# EasyEDA Pro project Chronos-Pad-EasyEDApro-Save.epro

# Schematic Schematic1
Board Name: Board1; Create Date: 2025-09-28; Page Name: P1; Project Name: MacroPad; Schematic Name: Schematic1; Update Date: 2025-10-20; Company: EasyEDA.com; Page Size: A4; Version: V1.0
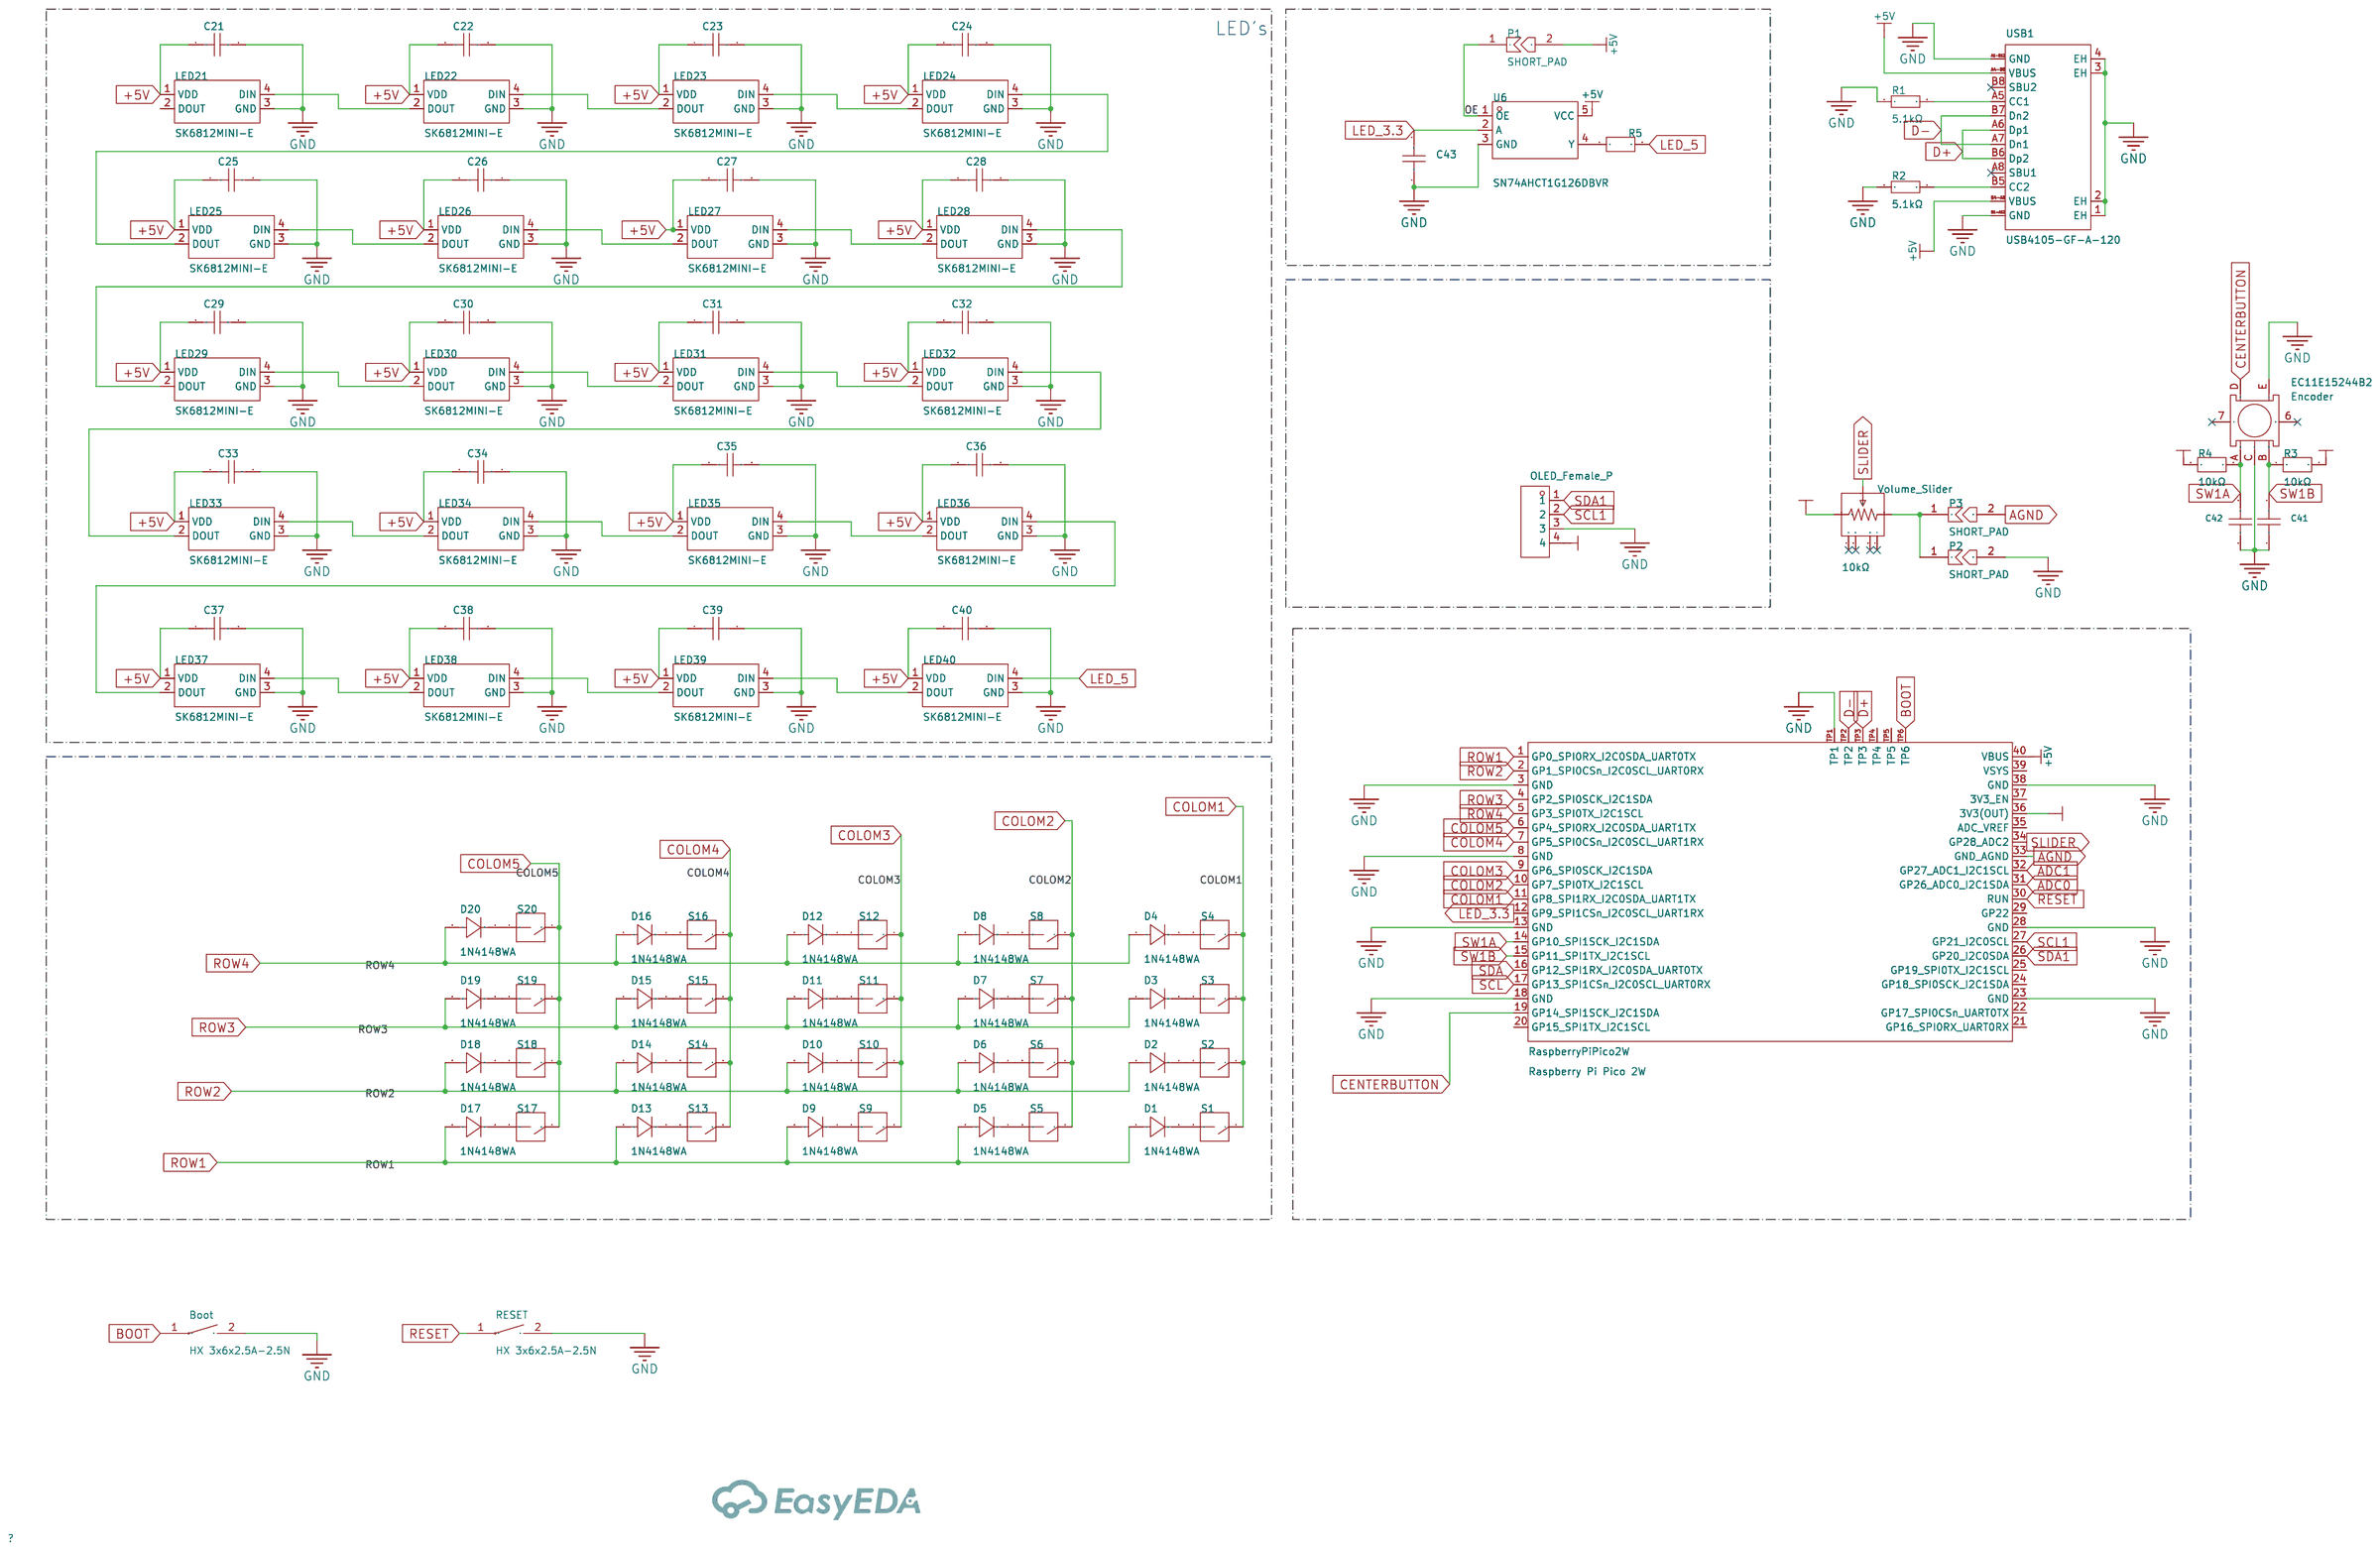
[diagram p0: schematic sheet]

## Parts
Boot  HX 3x6x2.5A-2.5N  [SW-SMD_HX-TS-1101-C-W]
C21  100nF  [C0805]
C22  100nF  [C0805]
C23  100nF  [C0805]
C24  100nF  [C0805]
C25  100nF  [C0805]
C26  100nF  [C0805]
C27  100nF  [C0805]
C28  100nF  [C0805]
C29  100nF  [C0805]
C30  100nF  [C0805]
C31  100nF  [C0805]
C32  100nF  [C0805]
C33  100nF  [C0805]
C34  100nF  [C0805]
C35  100nF  [C0805]
C36  100nF  [C0805]
C37  100nF  [C0805]
C38  100nF  [C0805]
C39  100nF  [C0805]
C40  100nF  [C0805]
C41  100nF  [C0805]
C42  100nF  [C0805]
C43  100nF  [C0805]
D1  1N4148WA  [SOD-123_L2.7-W1.7-LS3.8-RD]
D2  1N4148WA  [SOD-123_L2.7-W1.7-LS3.8-RD]
D3  1N4148WA  [SOD-123_L2.7-W1.7-LS3.8-RD]
D4  1N4148WA  [SOD-123_L2.7-W1.7-LS3.8-RD]
D5  1N4148WA  [SOD-123_L2.7-W1.7-LS3.8-RD]
D6  1N4148WA  [SOD-123_L2.7-W1.7-LS3.8-RD]
D7  1N4148WA  [SOD-123_L2.7-W1.7-LS3.8-RD]
D8  1N4148WA  [SOD-123_L2.7-W1.7-LS3.8-RD]
D9  1N4148WA  [SOD-123_L2.7-W1.7-LS3.8-RD]
D10  1N4148WA  [SOD-123_L2.7-W1.7-LS3.8-RD]
D11  1N4148WA  [SOD-123_L2.7-W1.7-LS3.8-RD]
D12  1N4148WA  [SOD-123_L2.7-W1.7-LS3.8-RD]
D13  1N4148WA  [SOD-123_L2.7-W1.7-LS3.8-RD]
D14  1N4148WA  [SOD-123_L2.7-W1.7-LS3.8-RD]
D15  1N4148WA  [SOD-123_L2.7-W1.7-LS3.8-RD]
D16  1N4148WA  [SOD-123_L2.7-W1.7-LS3.8-RD]
D17  1N4148WA  [SOD-123_L2.7-W1.7-LS3.8-RD]
D18  1N4148WA  [SOD-123_L2.7-W1.7-LS3.8-RD]
D19  1N4148WA  [SOD-123_L2.7-W1.7-LS3.8-RD]
D20  1N4148WA  [SOD-123_L2.7-W1.7-LS3.8-RD]
Encoder  EC11E15244B2  [SW-TH_EC11XXXXXXXX]
LED21  SK6812MINI-E  [LED-SMD_L3.2-W2.8-LS5.9_SK6812MINI-E]
LED22  SK6812MINI-E  [LED-SMD_L3.2-W2.8-LS5.9_SK6812MINI-E]
LED23  SK6812MINI-E  [LED-SMD_L3.2-W2.8-LS5.9_SK6812MINI-E]
LED24  SK6812MINI-E  [LED-SMD_L3.2-W2.8-LS5.9_SK6812MINI-E]
LED25  SK6812MINI-E  [LED-SMD_L3.2-W2.8-LS5.9_SK6812MINI-E]
LED26  SK6812MINI-E  [LED-SMD_L3.2-W2.8-LS5.9_SK6812MINI-E]
LED27  SK6812MINI-E  [LED-SMD_L3.2-W2.8-LS5.9_SK6812MINI-E]
LED28  SK6812MINI-E  [LED-SMD_L3.2-W2.8-LS5.9_SK6812MINI-E]
LED29  SK6812MINI-E  [LED-SMD_L3.2-W2.8-LS5.9_SK6812MINI-E]
LED30  SK6812MINI-E  [LED-SMD_L3.2-W2.8-LS5.9_SK6812MINI-E]
LED31  SK6812MINI-E  [LED-SMD_L3.2-W2.8-LS5.9_SK6812MINI-E]
LED32  SK6812MINI-E  [LED-SMD_L3.2-W2.8-LS5.9_SK6812MINI-E]
LED33  SK6812MINI-E  [LED-SMD_L3.2-W2.8-LS5.9_SK6812MINI-E]
LED34  SK6812MINI-E  [LED-SMD_L3.2-W2.8-LS5.9_SK6812MINI-E]
LED35  SK6812MINI-E  [LED-SMD_L3.2-W2.8-LS5.9_SK6812MINI-E]
LED36  SK6812MINI-E  [LED-SMD_L3.2-W2.8-LS5.9_SK6812MINI-E]
LED37  SK6812MINI-E  [LED-SMD_L3.2-W2.8-LS5.9_SK6812MINI-E]
LED38  SK6812MINI-E  [LED-SMD_L3.2-W2.8-LS5.9_SK6812MINI-E]
LED39  SK6812MINI-E  [LED-SMD_L3.2-W2.8-LS5.9_SK6812MINI-E]
LED40  SK6812MINI-E  [LED-SMD_L3.2-W2.8-LS5.9_SK6812MINI-E]
OLED_Female_P  -  [CONN-TH_4P-P2.50-XH2.54-4P]
P1  SHORT_PAD  [SHORT_PAD]
P2  SHORT_PAD  [SHORT_PAD]
P3  SHORT_PAD  [SHORT_PAD]
R1  5.1kΩ  [R0805]
R2  5.1kΩ  [R0805]
R3  10kΩ  [R0805]
R4  10kΩ  [R0805]
R5  300Ω  [R0805]
RaspberryPiPico2W  Raspberry Pi Pico 2W  [COMM-SMD_L51.0-W21.0-P2.54_PICOW]
RESET  HX 3x6x2.5A-2.5N  [SW-SMD_HX-TS-1101-C-W]
S1  adafruit_electromech_KBD_SWITCH_KAILH_SOCKET_BOX_JADE_KAILH_SOCKET  [KAILH_SOCKET]
S2  adafruit_electromech_KBD_SWITCH_KAILH_SOCKET_BOX_JADE_KAILH_SOCKET  [KAILH_SOCKET]
S3  adafruit_electromech_KBD_SWITCH_KAILH_SOCKET_BOX_JADE_KAILH_SOCKET  [KAILH_SOCKET]
S4  adafruit_electromech_KBD_SWITCH_KAILH_SOCKET_BOX_JADE_KAILH_SOCKET  [KAILH_SOCKET]
S5  adafruit_electromech_KBD_SWITCH_KAILH_SOCKET_BOX_JADE_KAILH_SOCKET  [KAILH_SOCKET]
S6  adafruit_electromech_KBD_SWITCH_KAILH_SOCKET_BOX_JADE_KAILH_SOCKET  [KAILH_SOCKET]
S7  adafruit_electromech_KBD_SWITCH_KAILH_SOCKET_BOX_JADE_KAILH_SOCKET  [KAILH_SOCKET]
S8  adafruit_electromech_KBD_SWITCH_KAILH_SOCKET_BOX_JADE_KAILH_SOCKET  [KAILH_SOCKET]
S9  adafruit_electromech_KBD_SWITCH_KAILH_SOCKET_BOX_JADE_KAILH_SOCKET  [KAILH_SOCKET]
S10  adafruit_electromech_KBD_SWITCH_KAILH_SOCKET_BOX_JADE_KAILH_SOCKET  [KAILH_SOCKET]
S11  adafruit_electromech_KBD_SWITCH_KAILH_SOCKET_BOX_JADE_KAILH_SOCKET  [KAILH_SOCKET]
S12  adafruit_electromech_KBD_SWITCH_KAILH_SOCKET_BOX_JADE_KAILH_SOCKET  [KAILH_SOCKET]
S13  adafruit_electromech_KBD_SWITCH_KAILH_SOCKET_BOX_JADE_KAILH_SOCKET  [KAILH_SOCKET]
S14  adafruit_electromech_KBD_SWITCH_KAILH_SOCKET_BOX_JADE_KAILH_SOCKET  [KAILH_SOCKET]
S15  adafruit_electromech_KBD_SWITCH_KAILH_SOCKET_BOX_JADE_KAILH_SOCKET  [KAILH_SOCKET]
S16  adafruit_electromech_KBD_SWITCH_KAILH_SOCKET_BOX_JADE_KAILH_SOCKET  [KAILH_SOCKET]
S17  adafruit_electromech_KBD_SWITCH_KAILH_SOCKET_BOX_JADE_KAILH_SOCKET  [KAILH_SOCKET]
S18  adafruit_electromech_KBD_SWITCH_KAILH_SOCKET_BOX_JADE_KAILH_SOCKET  [KAILH_SOCKET]
S19  adafruit_electromech_KBD_SWITCH_KAILH_SOCKET_BOX_JADE_KAILH_SOCKET  [KAILH_SOCKET]
S20  adafruit_electromech_KBD_SWITCH_KAILH_SOCKET_BOX_JADE_KAILH_SOCKET  [KAILH_SOCKET]
U6  SN74AHCT1G126DBVR  [SOT-23-5_L3.0-W1.7-P0.95-LS2.8-BR]
USB1  USB4105-GF-A-120  [USB-C-SMD_MC-311D]
Volume_Slider  10kΩ  [RES-ADJ-TH_PTA6043-2015DPB103]

## Library data of the parts
Boot RESET = HX 3x6x2.5A-2.5N: Circuit:SPST Actuator Style:Square Button Operating Force:2.5N Mounting Type:Surface Mount,Vertical Length:6mm Width:3.6mm Switch Height:2.5mm with Bracket:Without Bracket Contact Current:50mA Voltage Rating:12V Actuator/Cap Color:White With Lamp:No IP Ra; LCSC Part Name: 6*3.6*2.5mm 立贴 轻触开关; Supplier Part: C36498960; Manufacturer: hanxia(韩下); Supplier Footprint: SMD,3x6mm; JLCPCB Part Class: Extended Part; Datasheet: https://item.szlcsc.com/datasheet/HX%25203x6x2.5A-2.5N/38220902.html; Supplier: LCSC; Circuit: SPST; Actuator Style: Square Button; Operating Force: 2.5N; Mounting Type: Surface Mount,Vertical; Length: 6mm; Width: 3.6mm; Switch Height: 2.5mm; with Bracket: Without Bracket; Contact Current: 50mA; Voltage Rating: 12V; Actuator/Cap Color: White; With Lamp: No; Termination Style: SMD(SMT) Tab; Life: 30,000 Cycles; Operating Temperature: -25℃~+70℃
C21-C43 = CC0805KRX7R9BB104: Capacitance:100nF Tolerance:±10% Tolerance:±10% Voltage Rating:50V Temperature Coefficient:X7R; LCSC Part Name: 100nF ±10% 50V; Supplier Part: C49678; Manufacturer: YAGEO(国巨); Supplier Footprint: 0805; JLCPCB Part Class: Basic Part; Datasheet: https://item.szlcsc.com/datasheet/CC0805KRX7R9BB104/50686.html; Supplier: LCSC; Tolerance: ±10%; Voltage Rating: 50V; Temperature Coefficient: X7R
D1-D20 = 1N4148WA: Diode Configuration:Independent Voltage - Forward(Vf@If):1.25V@150mA Voltage - DC Reverse(Vr):75V Current - Rectified:150mA Pd - Power Dissipation:400mW Reverse Leakage Current (Ir):1uA Reverse Recovery Time (trr):4ns Operating Junction Temperature Range:; Supplier Part: C2977359; Manufacturer: PJSEMI(平晶微); Supplier Footprint: SOD-123W; JLCPCB Part Class: Extended Part; Datasheet: https://item.szlcsc.com/datasheet/1N4148WA/3386882.html; Supplier: LCSC; Diode Configuration: Independent; Voltage - Forward(Vf@If): 1.25V@150mA; Voltage - DC Reverse(Vr): 75V; Current - Rectified: 150mA; Pd - Power Dissipation: 400mW; Reverse Leakage Current (Ir): 1uA; Reverse Recovery Time (trr): 4ns; Non-Repetitive Peak Forward Surge Current: 4A
Encoder = EC11E15244B2_C470754: Supplier Part: C470754; Manufacturer: ALPSALPINE(阿尔卑斯阿尔派); Supplier Footprint: 插件; JLCPCB Part Class: Extended Part; Datasheet: https://atta.szlcsc.com/upload/public/pdf/source/20191216/C470795_DE763ECE59BD49533DB26DB53E5D34B2.pdf; Supplier: LCSC
LED21-LED40 = SK6812MINI-E_C5149201: Supplier Part: C5149201; Manufacturer: 欧思科光电; Supplier Footprint: SMD; JLCPCB Part Class: Extended Part; Datasheet: https://item.szlcsc.com/datasheet/SK6812MINI-E/5773397.html; Supplier: LCSC
OLED_Female_P = XH-2.54-4P: Supplier Part: C9900003933; Supplier Footprint: TH-4P; JLCPCB Part Class: Extended Part; Supplier: LCSC
P1-P3 = SHORT_PAD: _: 3
R1 R2 = MCR10EZPF5101: Resistance:5.1kΩ Tolerance:±1% Tolerance:±1% Power(Watts):125mW Temperature Coefficient:±100ppm/℃ Temperature Coefficient:±100ppm/℃; LCSC Part Name: 5.1kΩ ±1% 125mW; Supplier Part: C308410; Manufacturer: ROHM(罗姆); Supplier Footprint: 0805; JLCPCB Part Class: Extended Part; Datasheet: https://atta.szlcsc.com/upload/public/pdf/source/20180927/C308562_C105FB47EB7519E2A4C533708F7CD71F.pdf; Supplier: LCSC; Tolerance: ±1%; Power(Watts): 125mW; Temperature Coefficient: ±100ppm/℃
R3 R4 = SCR0805J10K: Type:Thick Film Resistors Resistance: Tolerance:±5% Tolerance:±5% Power(Watts): Overload Voltage (Max): Operating Temperature Range:-55℃~+155℃ Operating Temperature Range:-55℃~+155℃; LCSC Part Name: 厚膜电阻 10kΩ ±5% 125mW; Supplier Part: C5140188; Manufacturer: VO(翔胜); Supplier Footprint: 0805; JLCPCB Part Class: Extended Part; Datasheet: https://atta.szlcsc.com/upload/public/pdf/source/20220823/E5DDB4243192CD3C8AE9677163F934FF.pdf; Supplier: LCSC; Type: Thick Film Resistors; Tolerance: ±5%; Operating Temperature Range: -55℃~+155℃
R5 = CRCW0805300RFKEA: Type:Thick Film Resistors Resistance:300Ω Tolerance:±1% Tolerance:±1% Power(Watts):125mW Temperature Coefficient:±100ppm/℃ Temperature Coefficient:±100ppm/℃ Operating Temperature:-55℃~+155℃ Operating Temperature:-55℃~+155℃; LCSC Part Name: 厚膜电阻 300Ω ±1% 125mW; Supplier Part: C844837; Manufacturer: VISHAY(威世); Supplier Footprint: 0805; JLCPCB Part Class: Extended Part; Datasheet: https://item.szlcsc.com/datasheet/CRCW0805300RFKEA/904411.html; Supplier: LCSC; Type: Thick Film Resistors; Tolerance: ±1%; Power(Watts): 125mW; Temperature Coefficient: ±100ppm/℃; Operating Temperature: -55℃~+155℃
RaspberryPiPico2W = Raspberry Pi Pico 2W: Supplier Part: C42394205; Manufacturer: Raspberry Pi(树莓派); JLCPCB Part Class: Extended Part; Datasheet: https://item.szlcsc.com/datasheet/Raspberry%2520Pi%2520Pico%25202W/44334737.html; Supplier: LCSC
S1-S20 = adafruit_electromech_KBD_SWITCH_KAILH_SOCKET_BOX_JADE_KAILH_SOCKET
U6 = SN74AHCT1G126DBVR: Input type:- output type:Tri-State Voltage - Supply:4.5V~5.5V Voltage - Supply:4.5V~5.5V Number of Elements:1 Number of Bits per Element:1 Current - Output Low(IOL):8mA Current - Output High(IOH):8mA Logic Family:74AHCT Operating Temperature:-40℃~+125℃ Op; LCSC Part Name: 三态输出，单路总线缓冲门; Supplier Part: C163712; Manufacturer: TI(德州仪器); Supplier Footprint: SOT-23-5; JLCPCB Part Class: Extended Part; Datasheet: https://www.ti.com/cn/lit/gpn/sn74ahct1g126; Supplier: LCSC; output type: Tri-State; Voltage - Supply: 4.5V~5.5V; Number of Elements: 1; Number of Bits per Element: 1; Current - Output Low(IOL): 8mA; Current - Output High(IOH): 8mA; Logic Family: 74AHCT; Operating Temperature: -40℃~+125℃
USB1 = USB4105-GF-A-120: Connector Type:Type-C Protocol Standard:USB 2.0 Gender:Female Mounting Type:- Number of Contacts:16P Number of Ports:1 Current Rating-Power:- Voltage Rating:- Connect-Disconnect Life:- Supplementary Features:- Center Height:- Length:- Detection color:- Op; LCSC Part Name: Type-C 母; Supplier Part: C5184243; Manufacturer: GCT; Supplier Footprint: SMD; JLCPCB Part Class: Extended Part; Datasheet: https://item.szlcsc.com/datasheet/USB4105-GF-A-120/5849584.html; Supplier: LCSC; Connector Type: Type-C; Protocol Standard: USB 2.0; Gender: Female; Number of Contacts: 16P; Number of Ports: 1; Operating Temperature: -40℃~+85℃
Volume_Slider = PTA6043-2015DPB103: Resistance:10kΩ Tolerance:±20% Tolerance:±20% Power(Watts):250mW; LCSC Part Name: 10kΩ ±20%; Supplier Part: C17555413; Manufacturer: BOURNS; Supplier Footprint: 插件; JLCPCB Part Class: Extended Part; Datasheet: https://item.szlcsc.com/datasheet/PTA6043-2015DPB103/18684633.html; Supplier: LCSC; Tolerance: ±20%; Power(Watts): 250mW

## Nets
+3.3V: OLED_Female_P.4 R3.2 R4.1 RaspberryPiPico2W.36(3V3(OUT)) Volume_Slider.3
+5V: C21.1 C22.1 C23.1 C24.1 C25.1 C26.1 C27.1 C28.1 C29.1 C30.1 C31.1 C32.1 C33.1 C34.1 C35.1 C36.1 C37.1 C38.1 C39.1 C40.1 LED21.1(VDD) LED22.1(VDD) LED23.1(VDD) LED24.1(VDD) LED25.1(VDD) LED26.1(VDD) LED27.1(VDD) LED28.1(VDD) LED29.1(VDD) LED30.1(VDD) LED31.1(VDD) LED32.1(VDD) LED33.1(VDD) LED34.1(VDD) LED35.1(VDD) LED36.1(VDD) LED37.1(VDD) LED38.1(VDD) LED39.1(VDD) LED40.1(VDD) P1.2 RaspberryPiPico2W.40(VBUS) U6.5(VCC) USB1.A4-B9(VBUS) USB1.B4-A9(VBUS)
AGND: P3.2 RaspberryPiPico2W.33(GND_AGND)
GND: Boot.2 C21.2 C22.2 C23.2 C24.2 C25.2 C26.2 C27.2 C28.2 C29.2 C30.2 C31.2 C32.2 C33.2 C34.2 C35.2 C36.2 C37.2 C38.2 C39.2 C40.2 C41.1 C42.1 C43.1 Encoder.C Encoder.E LED21.3(GND) LED22.3(GND) LED23.3(GND) LED24.3(GND) LED25.3(GND) LED26.3(GND) LED27.3(GND) LED28.3(GND) LED29.3(GND) LED30.3(GND) LED31.3(GND) LED32.3(GND) LED33.3(GND) LED34.3(GND) LED35.3(GND) LED36.3(GND) LED37.3(GND) LED38.3(GND) LED39.3(GND) LED40.3(GND) OLED_Female_P.3 P2.2 R1.1 R2.1 RaspberryPiPico2W.3(GND) RaspberryPiPico2W.8(GND) RaspberryPiPico2W.13(GND) RaspberryPiPico2W.18(GND) RaspberryPiPico2W.23(GND) RaspberryPiPico2W.28(GND) RaspberryPiPico2W.38(GND) RaspberryPiPico2W.TP1 RESET.2 U6.3(GND) USB1.1(EH) USB1.2(EH) USB1.3(EH) USB1.4(EH) USB1.A1-B12(GND) USB1.B1-A12(GND)
ADC0: RaspberryPiPico2W.31(GP26_ADC0_I2C1SDA)
ADC1: RaspberryPiPico2W.32(GP27_ADC1_I2C1SCL)
BOOT: Boot.1 RaspberryPiPico2W.TP6
CENTERBUTTON: Encoder.D RaspberryPiPico2W.19(GP14_SPI1SCK_I2C1SDA)
COLOM1: RaspberryPiPico2W.11(GP8_SPI1RX_I2C0SDA_UART1TX) S1.1 S2.1 S3.1 S4.1
COLOM2: RaspberryPiPico2W.10(GP7_SPI0TX_I2C1SCL) S5.1 S6.1 S7.1 S8.1
COLOM3: RaspberryPiPico2W.9(GP6_SPI0SCK_I2C1SDA) S9.1 S10.1 S11.1 S12.1
COLOM4: RaspberryPiPico2W.7(GP5_SPI0CSn_I2C0SCL_UART1RX) S13.1 S14.1 S15.1 S16.1
COLOM5: RaspberryPiPico2W.6(GP4_SPI0RX_I2C0SDA_UART1TX) S17.1 S18.1 S19.1 S20.1
D+: RaspberryPiPico2W.TP3 USB1.A6(Dp1) USB1.B6(Dp2)
D-: RaspberryPiPico2W.TP2 USB1.A7(Dn1) USB1.B7(Dn2)
LED_3.3: C43.2 RaspberryPiPico2W.12(GP9_SPI1CSn_I2C0SCL_UART1RX) U6.2(A)
LED_5: LED40.4(DIN) R5.2
OE: P1.1 U6.1(OE)
RESET: RaspberryPiPico2W.30(RUN) RESET.1
ROW1: D1.2(A) D5.2(A) D9.2(A) D13.2(A) D17.2(A) RaspberryPiPico2W.1(GP0_SPI0RX_I2C0SDA_UART0TX)
ROW2: D2.2(A) D6.2(A) D10.2(A) D14.2(A) D18.2(A) RaspberryPiPico2W.2(GP1_SPI0CSn_I2C0SCL_UART0RX)
ROW3: D3.2(A) D7.2(A) D11.2(A) D15.2(A) D19.2(A) RaspberryPiPico2W.4(GP2_SPI0SCK_I2C1SDA)
ROW4: D4.2(A) D8.2(A) D12.2(A) D16.2(A) D20.2(A) RaspberryPiPico2W.5(GP3_SPI0TX_I2C1SCL)
SCL: RaspberryPiPico2W.17(GP13_SPI1CSn_I2C0SCL_UART0RX)
SCL1: OLED_Female_P.2 RaspberryPiPico2W.27(GP21_I2C0SCL)
SDA: RaspberryPiPico2W.16(GP12_SPI1RX_I2C0SDA_UART0TX)
SDA1: OLED_Female_P.1 RaspberryPiPico2W.26(GP20_I2C0SDA)
SLIDER: RaspberryPiPico2W.34(GP28_ADC2) Volume_Slider.2
SW1A: C42.2 Encoder.A R4.2 RaspberryPiPico2W.14(GP10_SPI1SCK_I2C1SDA)
SW1B: C41.2 Encoder.B R3.1 RaspberryPiPico2W.15(GP11_SPI1TX_I2C1SCL)
$1N1539: D1.1(C) S1.2
$1N1616: D2.1(C) S2.2
$1N1673: D3.1(C) S3.2
$1N1730: D4.1(C) S4.2
$1N1787: D5.1(C) S5.2
$1N1844: D6.1(C) S6.2
$1N1901: D7.1(C) S7.2
$1N1958: D8.1(C) S8.2
$1N2015: D9.1(C) S9.2
$1N2072: D10.1(C) S10.2
$1N2129: D11.1(C) S11.2
$1N2186: D12.1(C) S12.2
$1N2243: D13.1(C) S13.2
$1N2300: D14.1(C) S14.2
$1N2357: D15.1(C) S15.2
$1N2414: D16.1(C) S16.2
$1N2471: D17.1(C) S17.2
$1N2528: D18.1(C) S18.2
$1N2585: D19.1(C) S19.2
$1N2642: D20.1(C) S20.2
$1N3491: R1.2 USB1.A5(CC1)
$1N3495: R2.2 USB1.B5(CC2)
$1N10093: LED21.4(DIN) LED22.2(DOUT)
$1N10111: LED23.4(DIN) LED24.2(DOUT)
$1N10115: LED22.4(DIN) LED23.2(DOUT)
$1N10133: LED25.4(DIN) LED26.2(DOUT)
$1N10151: LED27.4(DIN) LED28.2(DOUT)
$1N10155: LED26.4(DIN) LED27.2(DOUT)
$1N10173: LED29.4(DIN) LED30.2(DOUT)
$1N10191: LED31.4(DIN) LED32.2(DOUT)
$1N10195: LED30.4(DIN) LED31.2(DOUT)
$1N10213: LED33.4(DIN) LED34.2(DOUT)
$1N10231: LED35.4(DIN) LED36.2(DOUT)
$1N10235: LED34.4(DIN) LED35.2(DOUT)
$1N10253: LED37.4(DIN) LED38.2(DOUT)
$1N10271: LED39.4(DIN) LED40.2(DOUT)
$1N10275: LED38.4(DIN) LED39.2(DOUT)
$1N47662: R5.1 U6.4(Y)
$1N83167: LED24.4(DIN) LED25.2(DOUT)
$1N83175: LED28.4(DIN) LED29.2(DOUT)
$1N83184: LED32.4(DIN) LED33.2(DOUT)
$1N83193: LED36.4(DIN) LED37.2(DOUT)
Net-(P2-1): P2.1 P3.1 Volume_Slider.1

Not connected (* = marked no-connect by the designer): Encoder 6* 7*; LED21 2(DOUT); RaspberryPiPico2W 20(GP15_SPI1TX_I2C1SCL) 21(GP16_SPI0RX_UART0RX) 22(GP17_SPI0CSn_UART0TX) 24(GP18_SPI0SCK_I2C1SDA) 25(GP19_SPI0TX_I2C1SCL) 29(GP22) 35(ADC_VREF) 37(3V3_EN) 39(VSYS) TP4 TP5; USB1 A8(SBU1)* B8(SBU2)*; Volume_Slider 4* 5* 6* 7*

## Notes on the sheet
- LED's

# Board PCB1
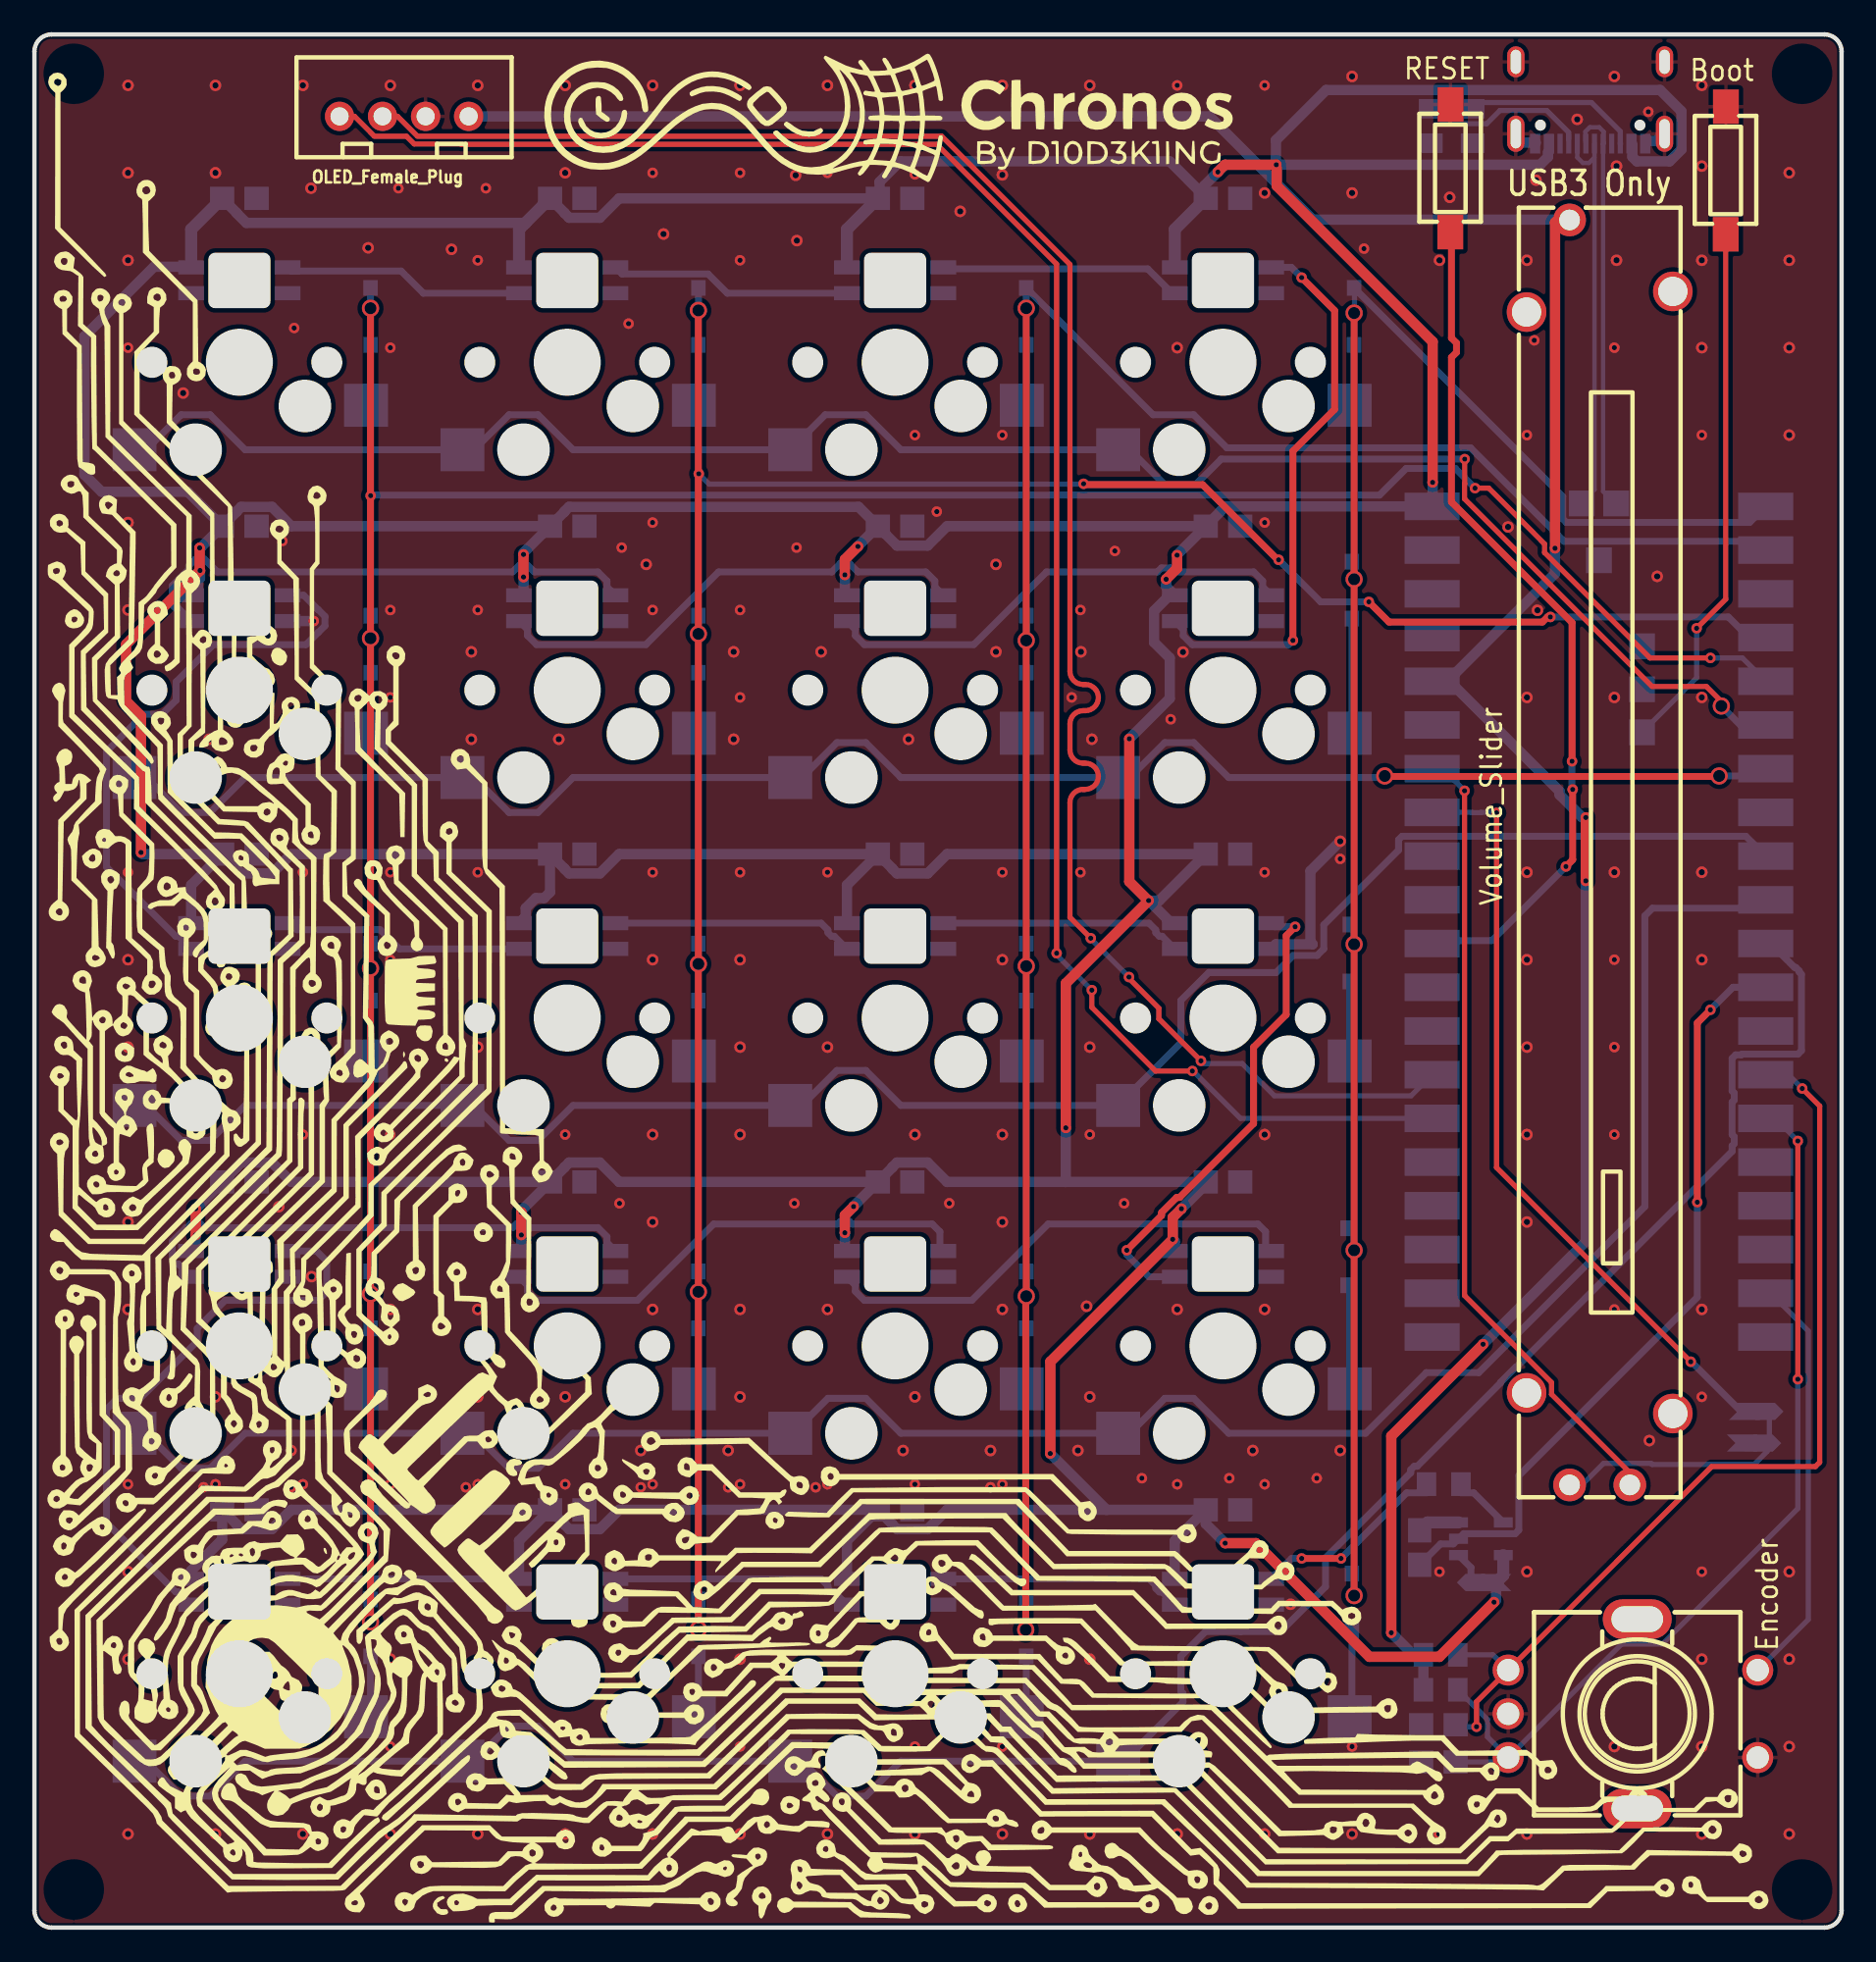
[diagram p1: board, top side]
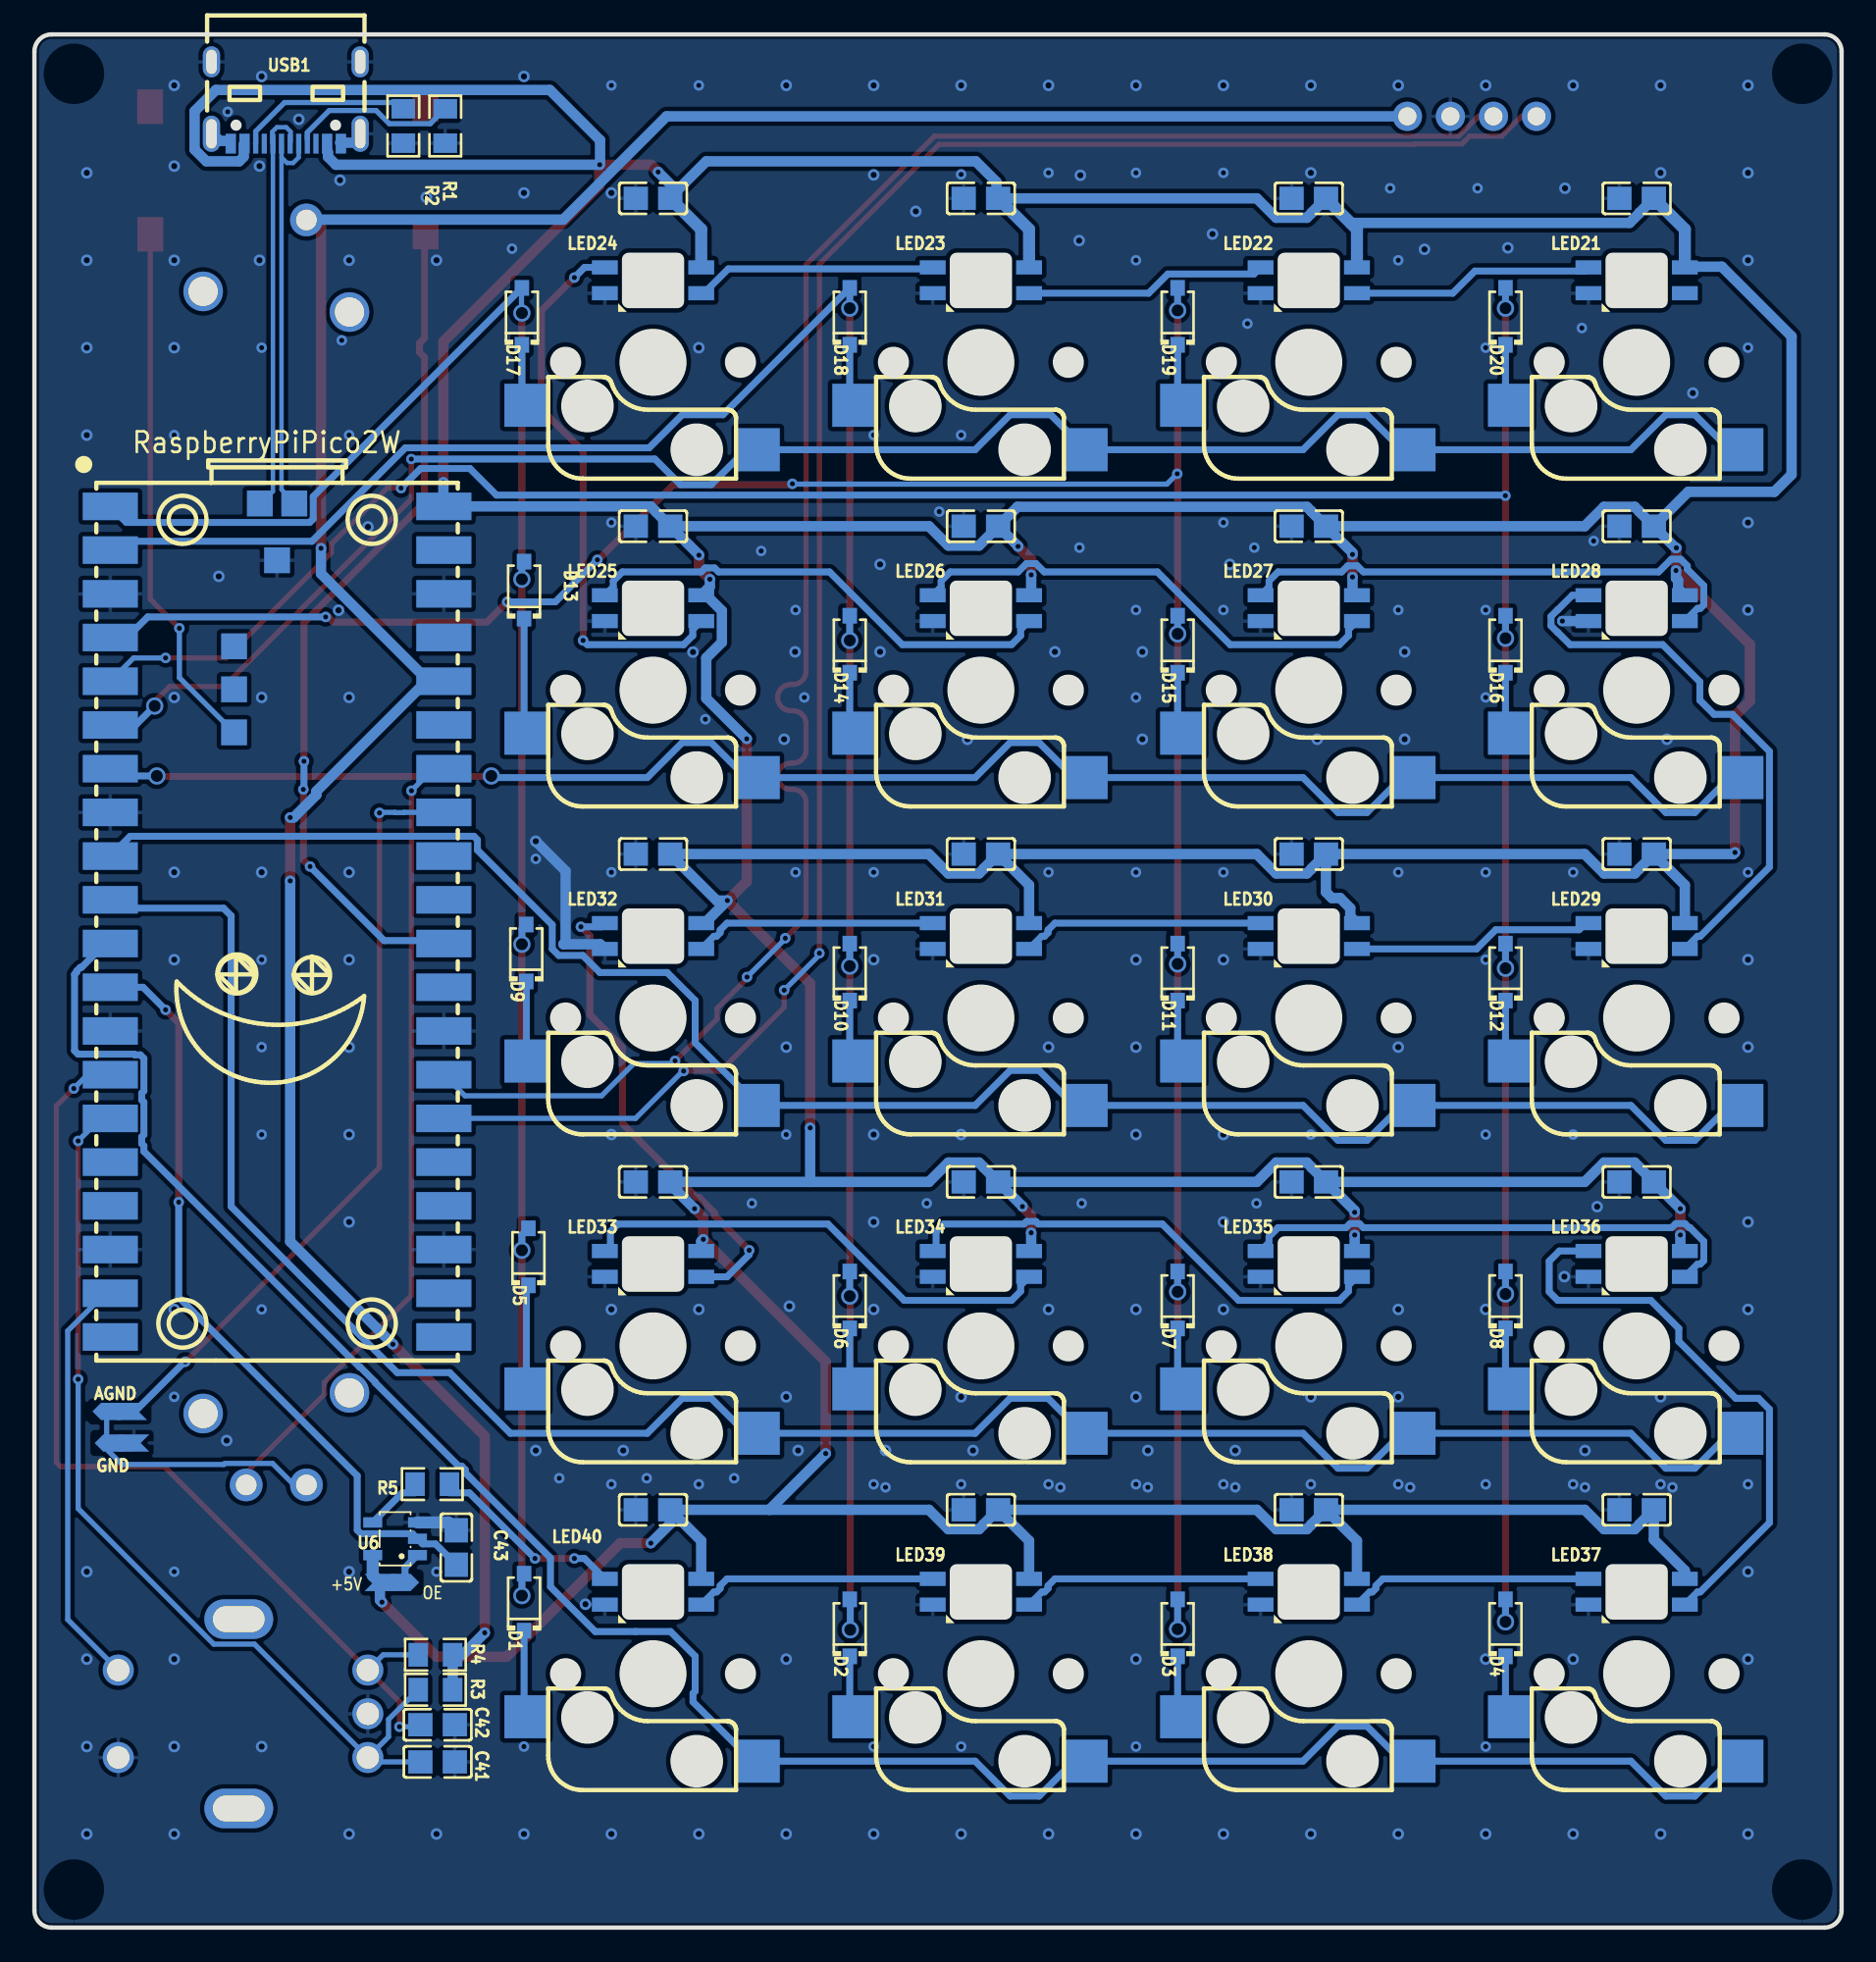
[diagram p2: board, bottom side, seen from below]

Outline 105 x 110 mm; copper layers: Top Layer, Bottom Layer. Coordinates in mm from the lower left corner of the outline.
Outline path: 0,109 0,1 arc(0.29,0.29) 1,0 104,0 arc(104.71,0.29) 105,1 105,109 arc(104.71,109.71) 104,110 1,110 arc(0.29,109.71) 0,109
Stack: Top Layer 0.035mm / Dielectric1 1.51mm FR4 er 4.5 / Bottom Layer 0.035mm

## Design rules (mm)
net SCL1: DP1
net SDA1: DP1
net D+: DP2
net D-: DP2
template: Custom Config
spacing copperThickness1oz (default): track to track 0.15, other pairs 0.152 to 0.3
spacing copperThickness2oz: track to track 0.203, other pairs 0.152 to 0.3
spacing copperThicknessInner0.5oz: track to track 0.089, other pairs 0.152 to 0.3
track width copperThickness1oz (default): min 0.3, default 0.3, max 2.54
track width copperThickness2oz: min 0.203, default 0.254, max 2.54
track width copperThickness0.5oz: min 0.089, default 0.254, max 2.54
track width trackWidth1: min 0.5, default 0.6, max 2.54
differential pair differentialPair (default): width min 0.127, default 0.254, max 2.54; gap min 0.152, default 0.152
via viaSize (default): diameter min 0.5, default 0.61, max 10; hole min 0.3, default 0.3, max 6.3
net GND uses trackWidth1
net +5V uses trackWidth1
net +3.3V uses trackWidth1

## Placement (name value [footprint] x y rotation side)
AGND  -  [SHORT_PAD]  100.48 29.99 180 bottom
Boot  HX 3x6x2.5A-2.5N  [SW-SMD_HX-TS-1101-C-W]  98.27 102.09 90 top
C21  100nF  [C0805]  69.06 24.28 0 bottom
C22  100nF  [C0805]  50.01 24.28 0 bottom
C23  100nF  [C0805]  30.96 24.28 0 bottom
C24  100nF  [C0805]  11.91 24.28 0 bottom
C25  100nF  [C0805]  69.06 43.32 0 bottom
C26  100nF  [C0805]  50.01 43.32 0 bottom
C27  100nF  [C0805]  30.96 43.32 0 bottom
C28  100nF  [C0805]  11.91 43.32 0 bottom
C29  100nF  [C0805]  69.06 62.38 0 bottom
C30  100nF  [C0805]  50.01 62.38 0 bottom
C31  100nF  [C0805]  30.96 62.38 0 bottom
C32  100nF  [C0805]  11.91 62.38 0 bottom
C33  100nF  [C0805]  69.06 81.42 0 bottom
C34  100nF  [C0805]  50.01 81.42 0 bottom
C35  100nF  [C0805]  30.96 81.42 0 bottom
C36  100nF  [C0805]  11.91 81.42 0 bottom
C37  100nF  [C0805]  69.06 100.47 0 bottom
C38  100nF  [C0805]  50.01 100.47 0 bottom
C39  100nF  [C0805]  30.96 100.47 0 bottom
C40  100nF  [C0805]  11.91 100.47 0 bottom
C41  100nF  [C0805]  81.57 9.63 0 bottom
C42  100nF  [C0805]  81.57 11.79 0 bottom
C43  100nF  [C0805]  80.49 22.08 270 bottom
D1  1N4148WA  [SOD-123_L2.7-W1.7-LS3.8-RD]  76.55 18.91 90 bottom
D2  1N4148WA  [SOD-123_L2.7-W1.7-LS3.8-RD]  57.63 17.42 90 bottom
D3  1N4148WA  [SOD-123_L2.7-W1.7-LS3.8-RD]  38.58 17.42 90 bottom
D4  1N4148WA  [SOD-123_L2.7-W1.7-LS3.8-RD]  19.53 17.42 90 bottom
D5  1N4148WA  [SOD-123_L2.7-W1.7-LS3.8-RD]  76.3 38.97 90 bottom
D6  1N4148WA  [SOD-123_L2.7-W1.7-LS3.8-RD]  57.63 36.47 90 bottom
D7  1N4148WA  [SOD-123_L2.7-W1.7-LS3.8-RD]  38.58 36.47 90 bottom
D8  1N4148WA  [SOD-123_L2.7-W1.7-LS3.8-RD]  19.53 36.47 90 bottom
D9  1N4148WA  [SOD-123_L2.7-W1.7-LS3.8-RD]  76.42 56.63 90 bottom
D10  1N4148WA  [SOD-123_L2.7-W1.7-LS3.8-RD]  57.63 55.52 90 bottom
D11  1N4148WA  [SOD-123_L2.7-W1.7-LS3.8-RD]  38.58 55.52 90 bottom
D12  1N4148WA  [SOD-123_L2.7-W1.7-LS3.8-RD]  19.53 55.52 90 bottom
D13  1N4148WA  [SOD-123_L2.7-W1.7-LS3.8-RD]  76.55 77.71 90 bottom
D14  1N4148WA  [SOD-123_L2.7-W1.7-LS3.8-RD]  57.63 74.57 90 bottom
D15  1N4148WA  [SOD-123_L2.7-W1.7-LS3.8-RD]  38.58 74.57 90 bottom
D16  1N4148WA  [SOD-123_L2.7-W1.7-LS3.8-RD]  19.53 74.57 90 bottom
D17  1N4148WA  [SOD-123_L2.7-W1.7-LS3.8-RD]  76.68 93.62 90 bottom
D18  1N4148WA  [SOD-123_L2.7-W1.7-LS3.8-RD]  57.63 93.62 90 bottom
D19  1N4148WA  [SOD-123_L2.7-W1.7-LS3.8-RD]  38.58 93.62 90 bottom
D20  1N4148WA  [SOD-123_L2.7-W1.7-LS3.8-RD]  19.53 93.62 90 bottom
Encoder  EC11E15244B2  [SW-TH_EC11XXXXXXXX]  92.88 12.42 270 top
GND  -  [SHORT_PAD]  100.35 28.15 180 bottom
LED21  SK6812MINI-E  [LED-SMD_L3.2-W2.8-LS5.9_SK6812MINI-E]  11.91 95.71 180 bottom
LED22  SK6812MINI-E  [LED-SMD_L3.2-W2.8-LS5.9_SK6812MINI-E]  30.96 95.71 180 bottom
LED23  SK6812MINI-E  [LED-SMD_L3.2-W2.8-LS5.9_SK6812MINI-E]  50.01 95.71 180 bottom
LED24  SK6812MINI-E  [LED-SMD_L3.2-W2.8-LS5.9_SK6812MINI-E]  69.06 95.71 180 bottom
LED25  SK6812MINI-E  [LED-SMD_L3.2-W2.8-LS5.9_SK6812MINI-E]  69.06 76.66 180 bottom
LED26  SK6812MINI-E  [LED-SMD_L3.2-W2.8-LS5.9_SK6812MINI-E]  50.01 76.66 180 bottom
LED27  SK6812MINI-E  [LED-SMD_L3.2-W2.8-LS5.9_SK6812MINI-E]  30.96 76.66 180 bottom
LED28  SK6812MINI-E  [LED-SMD_L3.2-W2.8-LS5.9_SK6812MINI-E]  11.91 76.66 180 bottom
LED29  SK6812MINI-E  [LED-SMD_L3.2-W2.8-LS5.9_SK6812MINI-E]  11.91 57.61 180 bottom
LED30  SK6812MINI-E  [LED-SMD_L3.2-W2.8-LS5.9_SK6812MINI-E]  30.96 57.61 180 bottom
LED31  SK6812MINI-E  [LED-SMD_L3.2-W2.8-LS5.9_SK6812MINI-E]  50.01 57.61 180 bottom
LED32  SK6812MINI-E  [LED-SMD_L3.2-W2.8-LS5.9_SK6812MINI-E]  69.06 57.61 180 bottom
LED33  SK6812MINI-E  [LED-SMD_L3.2-W2.8-LS5.9_SK6812MINI-E]  69.06 38.56 180 bottom
LED34  SK6812MINI-E  [LED-SMD_L3.2-W2.8-LS5.9_SK6812MINI-E]  50.01 38.56 180 bottom
LED35  SK6812MINI-E  [LED-SMD_L3.2-W2.8-LS5.9_SK6812MINI-E]  30.96 38.56 180 bottom
LED36  SK6812MINI-E  [LED-SMD_L3.2-W2.8-LS5.9_SK6812MINI-E]  11.91 38.56 180 bottom
LED37  SK6812MINI-E  [LED-SMD_L3.2-W2.8-LS5.9_SK6812MINI-E]  11.91 19.51 180 bottom
LED38  SK6812MINI-E  [LED-SMD_L3.2-W2.8-LS5.9_SK6812MINI-E]  30.96 19.51 180 bottom
LED39  SK6812MINI-E  [LED-SMD_L3.2-W2.8-LS5.9_SK6812MINI-E]  50.01 19.51 180 bottom
LED40  SK6812MINI-E  [LED-SMD_L3.2-W2.8-LS5.9_SK6812MINI-E]  69.06 19.51 180 bottom
OLED_Female_Plug  -  [CONN-TH_4P-P2.50-XH2.54-4P]  21.48 105.24 180 top
P1  -  [SHORT_PAD]  83.79 20.05 0 bottom
R1  5.1kΩ  [R0805]  81.13 104.68 90 bottom
R2  5.1kΩ  [R0805]  83.57 104.68 90 bottom
R3  10kΩ  [R0805]  81.7 13.82 180 bottom
R4  10kΩ  [R0805]  81.7 15.85 0 bottom
R5  300Ω  [R0805]  81.88 25.77 180 bottom
RaspberryPiPico2W  Raspberry Pi Pico 2W  [COMM-SMD_L51.0-W21.0-P2.54_PICOW]  90.9 58.53 270 bottom
RESET  HX 3x6x2.5A-2.5N  [SW-SMD_HX-TS-1101-C-W]  82.27 102.22 90 top
S1  adafruit_electromech_KBD_SWITCH_KAILH_SOCKET_BOX_JADE_KAILH_SOCKET  [KAILH_SOCKET]  69.06 14.75 180 top
S2  adafruit_electromech_KBD_SWITCH_KAILH_SOCKET_BOX_JADE_KAILH_SOCKET  [KAILH_SOCKET]  50.01 14.75 180 top
S3  adafruit_electromech_KBD_SWITCH_KAILH_SOCKET_BOX_JADE_KAILH_SOCKET  [KAILH_SOCKET]  30.96 14.75 180 top
S4  adafruit_electromech_KBD_SWITCH_KAILH_SOCKET_BOX_JADE_KAILH_SOCKET  [KAILH_SOCKET]  11.91 14.75 180 top
S5  adafruit_electromech_KBD_SWITCH_KAILH_SOCKET_BOX_JADE_KAILH_SOCKET  [KAILH_SOCKET]  69.06 33.8 180 top
S6  adafruit_electromech_KBD_SWITCH_KAILH_SOCKET_BOX_JADE_KAILH_SOCKET  [KAILH_SOCKET]  50.01 33.8 180 top
S7  adafruit_electromech_KBD_SWITCH_KAILH_SOCKET_BOX_JADE_KAILH_SOCKET  [KAILH_SOCKET]  30.96 33.8 180 top
S8  adafruit_electromech_KBD_SWITCH_KAILH_SOCKET_BOX_JADE_KAILH_SOCKET  [KAILH_SOCKET]  11.91 33.8 180 top
S9  adafruit_electromech_KBD_SWITCH_KAILH_SOCKET_BOX_JADE_KAILH_SOCKET  [KAILH_SOCKET]  69.06 52.85 180 top
S10  adafruit_electromech_KBD_SWITCH_KAILH_SOCKET_BOX_JADE_KAILH_SOCKET  [KAILH_SOCKET]  50.01 52.85 180 top
S11  adafruit_electromech_KBD_SWITCH_KAILH_SOCKET_BOX_JADE_KAILH_SOCKET  [KAILH_SOCKET]  30.96 52.85 180 top
S12  adafruit_electromech_KBD_SWITCH_KAILH_SOCKET_BOX_JADE_KAILH_SOCKET  [KAILH_SOCKET]  11.91 52.85 180 top
S13  adafruit_electromech_KBD_SWITCH_KAILH_SOCKET_BOX_JADE_KAILH_SOCKET  [KAILH_SOCKET]  69.06 71.9 180 top
S14  adafruit_electromech_KBD_SWITCH_KAILH_SOCKET_BOX_JADE_KAILH_SOCKET  [KAILH_SOCKET]  50.01 71.9 180 top
S15  adafruit_electromech_KBD_SWITCH_KAILH_SOCKET_BOX_JADE_KAILH_SOCKET  [KAILH_SOCKET]  30.96 71.9 180 top
S16  adafruit_electromech_KBD_SWITCH_KAILH_SOCKET_BOX_JADE_KAILH_SOCKET  [KAILH_SOCKET]  11.91 71.9 180 top
S17  adafruit_electromech_KBD_SWITCH_KAILH_SOCKET_BOX_JADE_KAILH_SOCKET  [KAILH_SOCKET]  69.06 90.95 180 top
S18  adafruit_electromech_KBD_SWITCH_KAILH_SOCKET_BOX_JADE_KAILH_SOCKET  [KAILH_SOCKET]  50.01 90.95 180 top
S19  adafruit_electromech_KBD_SWITCH_KAILH_SOCKET_BOX_JADE_KAILH_SOCKET  [KAILH_SOCKET]  30.96 90.95 180 top
S20  adafruit_electromech_KBD_SWITCH_KAILH_SOCKET_BOX_JADE_KAILH_SOCKET  [KAILH_SOCKET]  11.91 90.95 180 top
U6  SN74AHCT1G126DBVR  [SOT-23-5_L3.0-W1.7-P0.95-LS2.8-BR]  84.04 22.59 180 bottom
USB1  USB4105-GF-A-120  [USB-C-SMD_MC-311D]  90.39 106.03 0 bottom
Volume_Slider  10kΩ  [RES-ADJ-TH_PTA6043-2015DPB103]  90.95 62.47 90 top

## Footprints (pads in the part's own frame, mm; a bottom-side part is the same pattern mirrored in y, then rotated)
C0805
  rect 1.41x1.35 smd: 1(-1,0) 2(1,0)
COMM-SMD_L51.0-W21.0-P2.54_PICOW
  rect 1.6x3.2 smd: 1(-24.045,-9.69) 2(-21.505,-9.69) 3(-18.965,-9.69) 4(-16.425,-9.69) 5(-13.885,-9.69) 6(-11.345,-9.69) 7(-8.805,-9.69) 8(-6.265,-9.69) 9(-3.725,-9.69) 10(-1.185,-9.69) 11(1.355,-9.69) 12(3.895,-9.69) 13(6.435,-9.69) 14(8.975,-9.69) 15(11.515,-9.69) 16(14.055,-9.69) 17(16.595,-9.69) 18(19.135,-9.69) 19(21.675,-9.69) 20(24.215,-9.69) 21(24.215,9.69) 22(21.675,9.69) 23(19.135,9.69) 24(16.595,9.69) 25(14.055,9.69) 26(11.515,9.69) 27(8.975,9.69) 28(6.435,9.69) 29(3.895,9.69) 30(1.355,9.69) 31(-1.185,9.69) 32(-3.725,9.69) 33(-6.265,9.69) 34(-8.805,9.69) 35(-11.345,9.69) 36(-13.885,9.69) 37(-16.425,9.69) 38(-18.965,9.69) 39(-21.505,9.69) 40(-24.045,9.69)
  rect 1.5x1.5 smd: TP1(-20.915,0) TP2(-24.215,1) TP3(-24.215,-1) TP4(-15.915,-2.499) TP5(-13.415,-2.499) TP6(-10.915,-2.499)
CONN-TH_4P-P2.50-XH2.54-4P
  round 1.7 hole 1.05: 1(3.75,0) 2(1.25,0) 3(-1.25,0) 4(-3.75,0)
KAILH_SOCKET
  rect 2.55x2.5 smd far side: 1(6.09,5.08) 2(-7.36,2.5)
LED-SMD_L3.2-W2.8-LS5.9_SK6812MINI-E
  rect 1.5x0.82 smd: 1(2.8,0.75) 2(2.8,-0.75) 3(-2.8,-0.75) 4(-2.8,0.75)
R0805
  rect 1.133x1.377 smd: 1(-1,0) 2(1,0)
RES-ADJ-TH_PTA6043-2015DPB103
  round 1.9 hole 1.2: 1(-36.75,1.75) 2(-36.75,-1.75) 3(36.75,1.75)
  round 2.3 hole 1.7: 4(-31.4,4.25) 5(31.4,4.25) 6(-32.6,-4.25) 7(32.6,-4.25)
SHORT_PAD
  custom 1.643x1.001 smd: 1(-0.322,-0.001)
  custom 1.774x1.002 smd: 2(1.137,0.001)
SOD-123_L2.7-W1.7-LS3.8-RD
  rect 0.91x0.84 smd: 1(-1.655,0) 2(1.655,0)
SOT-23-5_L3.0-W1.7-P0.95-LS2.8-BR
  rect 1.1x0.6 smd: 1(1.3,-0.95) 2(1.3,0) 3(1.3,0.95) 4(-1.3,0.95) 5(-1.3,-0.95)
SW-SMD_HX-TS-1101-C-W
  rect 2x1.5 smd: 1(-3.708,0) 2(3.708,-0.013)
SW-TH_EC11XXXXXXXX
  oval 2.3x4 hole 1.5x3: 6(5.5,0.25) 7(-5.5,0.25)
  round 1.8 hole 1.3: A(-2.54,-7.25) B(2.54,-7.25) C(0,-7.25) D(-2.54,7.25) E(2.54,7.25)
USB-C-SMD_MC-311D
  oval 1x2.1 hole 0.6x1.7: 1(-4.32,1.802) 4(4.32,1.802)
  oval 1x1.8 hole 0.6x1.4: 2(-4.32,-2.377) 3(4.32,-2.377)
  rect 0.6x1.15 smd: A1-B12(-3.2,2.377) A4-B9(-2.4,2.377) B1-A12(3.2,2.377) B4-A9(2.4,2.377)
  rect 0.3x1.15 smd: A5(-1.25,2.377) A6(-0.25,2.377) A7(0.25,2.377) A8(1.25,2.377) B5(1.75,2.377) B6(0.75,2.377) B7(-0.75,2.377) B8(-1.75,2.377)

## Nets
As in the schematic, except:
+3.3V: OLED_Female_Plug.4 R3.2 R4.1 RaspberryPiPico2W.36 Volume_Slider.3
AGND: AGND.2 RaspberryPiPico2W.33
GND: Boot.2 C21.2 C22.2 C23.2 C24.2 C25.2 C26.2 C27.2 C28.2 C29.2 C30.2 C31.2 C32.2 C33.2 C34.2 C35.2 C36.2 C37.2 C38.2 C39.2 C40.2 C41.1 C42.1 C43.1 Encoder.C Encoder.E GND.2 LED21.3 LED22.3 LED23.3 LED24.3 LED25.3 LED26.3 LED27.3 LED28.3 LED29.3 LED30.3 LED31.3 LED32.3 LED33.3 LED34.3 LED35.3 LED36.3 LED37.3 LED38.3 LED39.3 LED40.3 OLED_Female_Plug.3 R1.1 R2.1 RaspberryPiPico2W.3 RaspberryPiPico2W.8 RaspberryPiPico2W.13 RaspberryPiPico2W.18 RaspberryPiPico2W.23 RaspberryPiPico2W.28 RaspberryPiPico2W.38 RaspberryPiPico2W.TP1 RESET.2 U6.3 USB1.1 USB1.2 USB1.3 USB1.4 USB1.A1-B12 USB1.B1-A12
SCL1: OLED_Female_Plug.2 RaspberryPiPico2W.27
SDA1: OLED_Female_Plug.1 RaspberryPiPico2W.26
$1N58671: AGND.1 GND.1 Volume_Slider.1

Pads without a net: Encoder 6 7; LED21 2; RaspberryPiPico2W 20 21 22 24 25 29 35 37 39 TP4 TP5; USB1 A8 B8; Volume_Slider 4 5 6 7

## Via types
v1: diameter 1, hole 0.7, Top Layer to Bottom Layer, 23 vias
v2: diameter 0.61, hole 0.3, Top Layer to Bottom Layer, 50 vias
v3: diameter 0.61, hole 0.305, Top Layer to Bottom Layer, 108 vias
v4: diameter 0.6, hole 0.3, Top Layer to Bottom Layer, 1 via
v5: diameter 0.67, hole 0.367, Top Layer to Bottom Layer, 154 vias

## Routing (per net, layer and track width the routed paths; a pad name or vN(x,y) marks a point on that pad's centre or on a via; arc(x,y) is an arc through that point)
+3.3V: length 162.7
  Top Layer w0.6: v3(90.14,64.5) v3(90.14,60.82) ; 88.35,80.15 88.35,99.07 88.45,99.17 ; v3(78.84,17.13) 78.84,28.56 v3(84.17,33.89)
  Bottom Layer w0.6: v3(90.14,64.5) 89.94,64.5 88.62,65.82 88.62,66.02 82.39,72.25 ; OLED_Female_Plug.4 68.27,105.24 74.27,99.24 88.42,99.24 ; v3(84.17,33.89) 90.14,39.86 v3(90.14,60.82) ; v3(78.84,17.13) 80.12,15.85 R4.1 R3.2 ; v3(88.35,80.14) 88.35,78.67 82.05,72.37
+5V: length 621.5
  Top Layer w0.6: v3(47.09,78.6) 47.09,79.49 v3(47.85,80.25) ; v3(47.09,40.37) 47.09,41.39 v3(47.59,41.89) ; v3(66.64,41.77) 66.14,41.26 v3(66.14,39.99) 59.02,32.88 v3(59.02,27.54) ; v3(28.29,41.56) v3(28.29,40.24) ; v3(69.18,22.34) 70.96,22.34 77.57,15.73 81.63,15.73 v3(84.81,18.91) ; v2(72.16,102.43) 69.18,102.43 68.76,102.01 ; v3(9.6,80.17) 9.6,78.87 v3(9.62,78.85) 5.32,74.55 5.32,71.28 6.19,70.4 v3(6.19,62.47) ; v3(64.74,59.67) 59.93,54.86 v3(59.93,46.47) ; v3(9.37,41.77) v3(9.37,40.24) ; v3(81.24,83.97) 81.24,92.14 72.18,101.2 72.18,102.24 ; v3(65.76,78.34) 66.39,78.98 v3(66.39,79.74) ; v3(28.42,79.78) v3(28.42,78.47) ; 64.71,59.69 63.61,60.78 v2(63.61,69.07)
  Bottom Layer w0.6: LED25.1 65.76,77.91 v3(65.76,78.34) ; 62.29,24.28 C21.1 ; 62.29,24.28 53.03,24.28 51.9,23.15 50.12,23.15 49.85,23.41 49.85,23.43 C22.1 ; 62.29,24.28 v3(59.02,27.54) ; C21.1 68.06,23.46 v3(69.18,22.34) ; C21.1 66.26,22.47 LED40.1 ; 67.96,100.63 67.96,101.2 v2(68.76,102.01) ; 67.96,100.63 68.27,100.32 ; 67.96,100.63 67.96,100.3 ; 67.96,100.63 65.96,102.62 50.3,102.62 49.1,101.43 49.1,100.37 ; C26.1 47.59,41.91 v3(47.59,41.89) ; C26.1 33.98,43.32 32.85,44.45 31.07,44.45 30.8,44.19 30.8,44.17 C27.1 ; C26.1 49.85,44.17 49.85,44.19 50.12,44.45 51.9,44.45 53.03,43.32 59.93,43.32 ; v3(28.29,40.24) 28.29,39.45 LED35.1 ; LED27.1 28.42,77.67 v3(28.42,78.47) ; C36.1 8.91,83.42 3.91,83.42 2.9,84.43 2.9,92.45 6.95,96.5 9.06,96.5 LED21.1 ; C36.1 9.65,80.17 v3(9.6,80.17) ; C36.1 11.75,82.27 11.75,82.29 12.02,82.55 13.8,82.55 14.93,81.42 C35.1 ; v3(9.37,40.24) 9.37,39.57 LED36.1 ; C35.1 30.8,82.27 30.8,82.29 31.07,82.55 47.88,82.55 C34.1 ; C35.1 28.42,79.88 v3(28.42,79.78) ; C27.1 28.29,41.66 v3(28.29,41.56) ; C27.1 14.93,43.32 13.8,44.45 12.02,44.45 11.75,44.19 11.75,44.17 C28.1 10.91,43.31 v3(9.37,41.77) ; P1.2 84.93,19.03 v3(84.81,18.91) ; v3(6.19,62.47) 6.29,62.38 C32.1 ; C31.1 29.96,60.16 29.61,59.82 29.13,59.82 28.55,59.23 28.55,58.75 LED30.1 ; C31.1 14.93,62.38 13.8,61.25 12.02,61.25 11.75,61.51 11.75,61.53 C32.1 ; C31.1 30.8,61.53 30.8,61.51 31.07,61.25 32.85,61.25 33.98,62.38 C30.1 ; C22.1 33.98,24.28 32.85,23.15 31.07,23.15 30.8,23.41 30.8,23.43 C23.1 ; C22.1 47.21,22.47 LED39.1 ; 28.53,99.05 12.31,99.05 11.75,99.61 11.75,99.63 C40.1 ; v3(66.14,39.99) 66.26,39.87 LED33.1 ; v3(9.62,78.85) 9.62,78.41 9.5,78.28 9.5,77.8 LED28.1 ; v3(66.39,79.74) 66.39,79.76 C33.1 ; LED37.1 9.11,20.74 10.91,22.54 C24.1 11.75,23.43 11.75,23.41 12.02,23.15 13.8,23.15 14.93,24.28 C23.1 ; LED34.1 47.09,39.43 v3(47.09,40.37) ; C33.1 68.9,82.27 68.9,82.29 69.19,82.58 RaspberryPiPico2W.40 81.24,82.6 v3(81.24,83.97) ; C33.1 53.03,81.42 51.9,80.3 50.12,80.3 49.01,81.41 C34.1 ; 72.13,102.51 72.13,103.85 75.05,106.77 94.46,106.77 95.69,105.53 95.69,103.31 95.01,102.63 93.11,102.63 92.84,102.89 92.84,103.62 ; C30.1 49.85,61.53 49.85,61.51 50.12,61.25 51.9,61.25 53.03,62.38 C29.1 65.36,59.67 v3(64.74,59.67) 66.05,58.36 LED32.1 ; C30.1 47.21,60.57 LED31.1 ; C23.1 28.16,22.47 LED38.1 ; v3(47.09,78.6) 47.09,77.53 LED26.1 ; C38.1 33.98,100.47 32.85,99.35 31.07,99.35 30.8,99.61 30.8,99.63 C39.1 ; C34.1 47.85,80.27 v3(47.85,80.25) ; 59.93,43.32 C25.1 68.06,43.18 v3(66.64,41.77) ; 59.93,43.32 v3(59.93,46.47) ; C32.1 9.11,60.57 LED29.1 ; v2(72.16,102.43) 87.48,102.43 87.95,102.89 87.95,103.15 88,103.2 ; 65.96,77.46 65.96,77.42 65.06,76.51 65.06,74.68 65.96,73.77 65.96,71.42 v2(63.61,69.07) ; 67.69,100.41 67.91,100.62
  Bottom Layer w0.7: LED21.1 9.11,98.67 C40.1 ; 85.34,21.64 85.34,20.47 P1.2 ; C39.1 28.16,98.67 LED22.1 ; LED23.1 47.21,98.67 C38.1 ; 67.92,100.34 66.26,98.67 LED24.1
AGND: length 44.4
  Top Layer w0.3: v3(84.95,64.77) 84.95,44.16 v3(96.24,32.88)
  Bottom Layer w0.3: RaspberryPiPico2W.33 83.52,64.8 83.54,64.78 84.04,64.78 84.06,64.8 84.92,64.8 v3(84.95,64.77)
  Bottom Layer w0.4: 99.1,30.06 99.09,30.06 96.24,32.91
GND: length 14.9
  Bottom Layer w0.6: LED32.3 72.13,57.13 74.26,57.13 74.14,57.26 74.14,61.39 v5(75.87,63.12) ; LED28.3 v3(16.23,75.91) ; 94.35,103.94 94.23,103.81 93.68,103.81 ; 86.32,103.73 86.34,103.71 87.24,103.71
  Bottom Layer w0.7: U6.3 80.95,23.54 C43.1
  vias: v2(9.83,25.58) v2(14.91,25.58) v2(15.6,46.08) v2(20.68,46.08) v2(21.15,101.06) v2(25.07,25.58) v2(26.23,101.06) v2(33.99,42.08) v2(34.12,80.18) v2(35.23,25.58) v2(35.92,101.96) v2(40.31,25.58) v2(41,101.96) v2(44.15,42.08) v2(44.28,80.18) v2(45.39,25.58) v2(46.08,101.96) v2(51.16,101.87) v2(53.15,42.08) v2(55.55,25.58) v2(63.31,42.08) v2(64.35,26.11) v2(66.4,107.04) v2(69.43,26.11) v2(71.48,107.04) v2(74.51,26.11) v2(75.87,62.1) v2(77.25,97.55) v2(86.72,86.72) v2(91.8,91.8) v2(91.8,56.24) v2(91.8,51.16) v2(91.8,46.08) v2(91.8,35.92) v2(93.77,105.51) v2(96.88,86.72) v2(96.88,30.84) v2(96.88,20.68) v3(5.44,91.8) v3(5.44,61.32) v3(5.44,25.76) v3(10.52,25.76) v3(14.4,80.57) v3(15.09,92.94) v3(15.6,61.32) v3(15.6,25.76) v3(20.68,91.8) v3(20.68,76.56) v3(20.68,71.48) v3(20.68,61.32) v3(20.68,56.24) v3(20.68,25.76) v3(20.68,10.52) v3(25.76,96.88) v3(25.76,76.56) v3(25.76,61.32) v3(25.76,25.76) v3(30.84,46.08) v3(30.84,25.76) v3(34.52,93.19) v3(35.92,81.64) v3(35.92,76.56) v3(35.92,61.32) v3(35.92,25.76) v3(41,96.88) v3(41,76.56) v3(41,71.48) v3(41,61.32) v3(41,25.76) v3(41,10.52) v3(46.08,61.32) v3(46.08,25.76) v3(51.16,86.72) v3(51.16,25.76) v3(51.16,10.52) v3(52.43,82.27) v3(56.24,86.72) v3(56.24,61.32) v3(56.24,25.76) v3(56.24,10.52) v3(60.27,71.48) v3(60.77,76.56) v3(60.77,61.32) v3(61.32,46.08) v3(62.78,79.99) v3(66.02,70.21) v3(66.4,25.76) v3(71.48,81.64) v3(71.48,61.32) v3(71.48,25.76) v3(76.56,10.52) v3(81.64,20.68) v3(87.15,92.22) v5(5.44,107.04) v5(5.44,101.96) v5(5.44,96.88) v5(5.44,81.64) v5(5.44,76.56) v5(5.44,56.24) v5(5.44,51.16) v5(5.44,41) v5(5.44,35.92) v5(5.44,20.68) v5(5.44,15.6) v5(5.44,5.44) v5(8.64,89.16) v5(10.15,69.05) v5(10.52,107.04) v5(10.52,101.96) v5(10.52,30.84) v5(10.52,5.44) v5(14.2,41.89) v5(14.91,27.72) v5(15.6,107.04) v5(15.6,15.6) v5(15.6,5.44) v5(16.07,101.06) v5(16.11,37.82) v5(19.39,97.6) v5(20.68,107.04) v5(20.68,35.92) v5(20.68,15.6) v5(20.68,5.44) v5(24.23,97.51) v5(25.39,74.13) v5(25.39,69.05) v5(25.76,107.04) v5(25.76,51.16) v5(25.76,35.92) v5(25.76,30.84) v5(25.76,5.44) v5(30.47,69.05) v5(30.84,107.04) v5(30.84,101.96) v5(30.84,30.84) v5(30.84,5.44) v5(35.23,27.72) v5(35.55,79.21) v5(35.92,107.04) v5(35.92,56.24) v5(35.92,46.08) v5(35.92,41) v5(35.92,35.92) v5(35.92,5.44) v5(36.55,98.4) v5(40.31,27.72) v5(40.63,74.13) v5(40.63,69.05) v5(41,107.04) v5(41,56.24) v5(41,51.16) v5(41,46.08) v5(41,35.92) v5(41,30.84) v5(41,15.6) v5(41,5.44) v5(44.23,101.82) v5(44.3,98.02) v5(45.71,74.13) v5(46.08,107.04) v5(46.08,51.16) v5(46.08,35.92) v5(46.08,5.44) v5(50.47,27.72) v5(50.79,69.05) v5(51.16,107.04) v5(51.16,46.08) v5(51.16,30.84) v5(51.16,5.44) v5(53.79,99.72) v5(55.55,27.72) v5(55.87,79.21) v5(55.87,74.13) v5(56.24,107.04) v5(56.24,101.84) v5(56.24,56.24) v5(56.24,46.08) v5(56.24,41) v5(56.24,35.92) v5(56.24,5.44) v5(60.63,27.72) v5(60.8,74.13) v5(61.13,36.1) v5(61.32,107.04) v5(61.32,51.16) v5(61.32,30.84) v5(61.32,15.6) v5(61.32,5.44) v5(61.44,69.05) v5(66.4,91.8) v5(66.4,35.92) v5(66.4,5.44) v5(66.73,74.11) v5(70.79,27.72) v5(71.48,100.79) v5(71.48,46.08) v5(71.48,35.92) v5(71.48,5.44) v5(72.98,18.79) v5(75.87,27.72) v5(76.56,107.56) v5(76.56,100.79) v5(76.56,5.44) v5(81.64,96.88) v5(81.64,5.44) v5(82.23,100.54) v5(85.62,81.39) v5(86.72,96.88) v5(86.72,71.48) v5(86.72,61.32) v5(86.72,56.24) v5(86.72,51.16) v5(86.72,46.08) v5(86.72,41) v5(86.72,20.68) v5(86.72,5.44) v5(87.25,101.53) v5(87.33,76.54) v5(89.64,105.06) v5(91.8,107.56) v5(91.8,71.48) v5(91.8,61.32) v5(91.8,10.52) v5(91.92,102.35) v5(91.92,96.88) v5(93.83,28.3) v5(94.29,78.51) v5(96.88,107.04) v5(96.88,102.35) v5(96.88,96.88) v5(96.88,91.8) v5(96.88,71.48) v5(96.88,61.32) v5(96.88,56.24) v5(96.88,35.92) v5(96.88,15.6) v5(96.88,10.52) v5(96.88,5.44) v5(101.96,101.96) v5(101.96,96.88) v5(101.96,91.8) v5(101.96,86.72) v5(101.96,20.68) v5(101.96,15.6) v5(101.96,10.52) v5(101.96,5.44)
BOOT: length 31
  Top Layer w0.3: Boot.1 98.27,77.19 v3(96.58,75.5)
  Bottom Layer w0.3: RaspberryPiPico2W.TP6 96.58,72.62 v3(96.58,75.5)
CENTERBUTTON: length 24.3
  Bottom Layer w0.3: RaspberryPiPico2W.19 100.88,36.86 103.07,34.67 103.07,17.9 Encoder.D
COLOM1: length 132.6
  Bottom Layer w0.4: S4.1 6.49,9.67 8.53,7.64 10.21,7.64 12.24,9.67 S3.1 24.97,9.77 25.37,9.77 25.46,9.67 25.54,9.67 27.58,11.7 29.26,11.7 31.29,9.67 S2.1 44.59,9.67 46.63,7.64 48.31,7.64 50.34,9.67 S1.1 63.29,9.67 66.73,13.11 66.73,13.61 66.61,13.73 66.61,15.76 68.04,17.2 70.07,17.2 70.07,17.2 72.41,17.2 75.02,19.8 75.02,21.48 79.97,26.43 79.97,26.6 80.17,26.81 80.34,26.81 85.19,31.66 85.19,31.69 86.07,32.57 86.11,32.57 98.64,45.1 98.64,45.42 98.77,45.55 98.77,45.95 98.64,46.07 98.64,47.96 98.77,48.09 98.77,48.49 98.64,48.61 98.64,50.5 98.85,50.71 99.17,50.71 99.21,50.75 102.46,50.75 102.67,50.96 102.67,55.39 102.54,55.51 102.54,55.58 102.34,55.79 102.27,55.79 101.07,56.98 100.79,56.98 RaspberryPiPico2W.11
COLOM2: length 124.2
  Bottom Layer w0.4: S8.1 6.49,28.72 8.53,26.69 10.21,26.69 12.24,28.72 S7.1 25.54,28.72 27.58,26.69 29.26,26.69 31.29,28.72 S6.1 44.07,28.72 46.1,30.75 48.31,30.75 50.34,28.72 S5.1 63.64,28.72 65.68,30.75 67.36,30.75 69.39,28.72 77.35,28.72 80.87,32.24 83.92,32.24 93.57,41.89 93.57,58.79 94.01,59.23 100.11,59.23 RaspberryPiPico2W.10
COLOM3: length 109.4
  Bottom Layer w0.4: S12.1 6.49,47.77 8.53,45.74 10.21,45.74 12.24,47.77 S11.1 25.54,47.77 27.58,45.74 29.26,45.74 31.29,47.77 S10.1 44.59,47.77 46.63,49.8 48.31,49.8 50.34,47.77 S9.1 66.61,51.41 66.61,53.86 68.24,55.49 72.15,55.49 73.14,56.48 74.53,56.48 74.91,56.87 74.91,58.26 79.26,62.61 79.26,63.2 79.47,63.41 99.44,63.41 RaspberryPiPico2W.9
COLOM4: length 101.7
  Top Layer w0.4: v1(78.46,66.91) 78.49,66.88 97.86,66.88 v1(97.89,66.91)
  Bottom Layer w0.4: S16.1 6.49,66.82 8.53,64.79 10.21,64.79 12.24,66.82 S15.1 25.54,66.82 27.58,64.79 29.26,64.79 31.29,66.82 S14.1 44.59,66.82 46.63,68.85 48.31,68.85 50.34,66.82 S13.1 63.64,66.82 65.68,68.85 67.36,68.85 69.39,66.82 78.36,66.82 v1(78.46,66.91) ; v1(97.89,66.91) 100.17,66.91 RaspberryPiPico2W.7
COLOM5: length 108.4
  Top Layer w0.3: v4(83.1,85.33) 83.1,83.9 83.09,83.89 83.09,83.01 93.99,72.11 97.14,72.11 98.02,71.23 98.02,70.96
  Bottom Layer w0.4: RaspberryPiPico2W.6 99.11,69.88 v1(98.01,70.98) ; S20.1 6.49,85.87 8.53,87.9 10.21,87.9 12.24,85.87 S19.1 ; 25.64,85.96 27.58,87.9 29.26,87.9 31.29,85.87 S18.1 45.95,87.9 48.31,87.9 50.34,85.87 S17.1 63.64,85.87 65.68,83.84 67.46,83.84 68.95,85.33 v4(83.1,85.33)
D+: length 23
  Bottom Layer w0.254: 90.11,103.75 90.11,104.35 90.37,104.61 90.91,104.61 91.18,104.34 91.18,103.69 USB1.B6 91.14,83.45 91.31,83.28
D-: length 23
  Bottom Layer w0.254: 90.03,82.94 90.64,83.55 USB1.A7 ; 90.64,102.85 90.32,102.53 89.97,102.53 89.64,102.86 USB1.B7
LED_3.3: length 45.2
  Top Layer w0.4: v3(97.38,53.32) 96.62,52.56 v3(96.62,42.15)
  Bottom Layer w0.4: C43.2 81.7,22.29 82.45,22.29 U6.2 83.04,22.89 86.04,22.89 86.25,23.09 86.25,26.26 96.62,36.63 v3(96.62,42.15) ; RaspberryPiPico2W.12 98.69,54.64 v3(97.38,53.32)
LED_5: length 11.1
  Top Layer w0.4: v3(75.92,21.45) v3(73.63,21.45)
  Bottom Layer w0.4: v3(75.92,21.45) 79.73,25.26 80.88,25.26 ; LED40.4 73.04,21.45 v3(73.63,21.45)
OE: length 1.9
  Bottom Layer w0.4: P1.1 83.47,20.92 82.74,21.64
RESET: length 49.6
  Top Layer w0.4: 82.33,98.21 82.33,92.36 82.63,92.07 82.63,91.53 82.33,91.23 82.33,82.83 89.34,75.82 v2(89.34,67.77) ; v2(89.38,66.13) 89.38,62.04 v2(88.98,61.65)
  Bottom Layer w0.4: v2(89.34,67.77) 89.34,66.17 v2(89.38,66.13) ; 81.05,57.35 84.68,57.35 v2(88.98,61.65)
ROW1: length 111.7
  Top Layer w0.4: v1(76.68,19.29) v1(76.68,39.35) v1(76.68,57.13) v1(76.68,78.34) v1(76.68,93.81)
  Bottom Layer w0.3: 76.7,93.79 76.7,95.17
  Bottom Layer w0.4: v1(76.68,19.29) 76.68,20.44 D1.2 ; v1(76.68,78.34) 76.68,79.24 D13.2 ; D9.2 76.68,58.03 v1(76.68,57.13) ; D5.2 76.68,40.25 v1(76.68,39.35) ; D17.2 88.8,83.15 88.8,81.85 89.01,81.64 99.66,81.64 RaspberryPiPico2W.1
ROW2: length 133.2
  Top Layer w0.4: v1(57.6,17.3) 57.6,36.66 v1(57.63,36.69) v1(57.63,55.86) v1(57.63,74.79) v1(57.63,94.09)
  Bottom Layer w0.4: RaspberryPiPico2W.2 100.08,80.55 88.87,80.55 83.44,85.98 69.28,85.98 67.36,87.9 65,87.9 D18.2 v1(57.63,94.09) ; D2.2 57.6,19.04 v1(57.6,17.3) ; v1(57.63,36.69) D6.2 ; v1(57.63,74.79) D14.2 ; D10.2 v1(57.63,55.86)
ROW3: length 147.8
  Top Layer w0.4: v1(38.58,17.34) v1(38.58,36.94) v1(38.58,55.99) v1(38.58,75.17) v1(38.58,93.96) ; v2(77.53,77.03) 78.71,75.85 87.62,75.85 87.92,76.15 v2(88.08,76.15) ; v2(60.96,83.89) 61.01,83.84 67.88,83.84 72.17,79.54
  Bottom Layer w0.3: v2(38.6,84.47) 39.2,83.87 60.96,83.87
  Bottom Layer w0.4: v1(38.58,55.99) D11.2 ; v2(88.08,76.15) 98.42,76.15 99.36,75.2 ; v1(38.58,17.34) D3.2 ; v1(38.58,36.94) D7.2 ; v2(77.53,77.03) 74.73,77.03 v2(72.29,79.47) ; v1(38.58,75.17) D15.2 ; D19.2 v1(38.58,93.96)
ROW4: length 170.1
  Top Layer w0.3: v3(97.38,73.77) 93.86,73.77 87.74,79.89 87.74,80.4 84.5,83.64 v3(83.7,83.64)
  Top Layer w0.4: v1(19.53,17.76) v1(19.53,36.81) v1(19.53,55.74) v1(19.53,74.91) v1(19.53,94.09)
  Bottom Layer w0.3: v3(97.38,73.77) 99.24,73.77 RaspberryPiPico2W.5
  Bottom Layer w0.4: D20.2 v1(19.53,94.09) ; v1(19.53,55.74) D12.2 ; v1(19.53,74.91) D16.2 ; v1(19.53,17.76) D4.2 ; v3(83.7,83.64) 82.56,84.78 79.7,84.78 78.15,83.23 19.48,83.23 19.44,83.2 ; v1(19.53,36.81) D8.2
  vias: v2(19.54,83.2)
SCL1: length 111.7
  Top Layer w0.3: v3(63.6,55.23) 63.6,55.15 65.33,53.41 65.33,52.8 v3(67.78,50.36) ; v3(61.38,57.49) 60.17,58.69 60.17,65.37 arc(60.39,65.91) 60.93,66.13 61.06,66.13 arc(61.82,66.9) 61.06,67.66 60.93,67.66 arc(60.39,67.88) 60.17,68.42 60.17,69.94 arc(60.39,70.48) 60.93,70.71 61.06,70.71 arc(61.82,71.47) 61.06,72.23 60.93,72.23 arc(60.39,72.45) 60.17,72.99 60.17,96.63 52.71,104.09 22.25,104.09 21.1,105.24 OLED_Female_Plug.2
  Bottom Layer w0.3: v3(63.6,55.23) 61.38,57.45 v3(61.38,57.49) ; v3(67.78,50.36) 67.93,50.2 70.17,50.2 72.05,48.33 79.98,48.33 RaspberryPiPico2W.27
SDA1: length 111.7
  Top Layer w0.3: v3(61.44,54.47) 61.44,53.47 65.14,49.77 v3(67.28,49.77) ; OLED_Female_Plug.1 18.6,105.24 19.75,104.09 21.61,104.09 22.06,103.64 24.79,103.64 24.82,103.61 52.44,103.61 59.39,96.65 v3(59.39,56.61)
  Bottom Layer w0.3: v3(67.28,49.77) 67.3,49.75 67.34,49.75 70.07,47.02 RaspberryPiPico2W.26 ; v3(61.44,54.47) 59.39,56.51 v3(59.39,56.61)
SLIDER: length 47
  Top Layer w0.3: v3(83.09,66.05) 83.09,36.72 88.15,31.67 88.15,30.98 93.41,25.72
  Bottom Layer w0.3: RaspberryPiPico2W.34 81.81,67.34 v3(83.09,66.05)
SW1A: length 56.3
  Top Layer w0.3: v3(102.71,48.75) 103.73,47.74 103.73,27.04 103.48,26.79 97.45,26.79 Encoder.A 83.79,13.12 v3(83.79,11.67)
  Bottom Layer w0.3: R4.2 84.74,15.85 Encoder.A ; C42.2 82.69,11.67 v3(83.79,11.67) ; RaspberryPiPico2W.14 101.91,49.56 v3(102.71,48.75)
SW1B: length 54.9
  Top Layer w0.3: v3(102.46,31.86) v3(102.46,45.7)
  Bottom Layer w0.3: v3(102.46,31.86) 102.46,24.35 94.58,16.47 92.22,16.47 Encoder.B ; v3(102.46,45.7) 101.15,47.02 RaspberryPiPico2W.15 ; Encoder.B 84.43,11.08 84.43,12.09 R3.1 ; Encoder.B 85.37,9.63 C41.2
$1N1539: length 5.1
  Bottom Layer w0.4: D1.1 76.55,12.38 S1.2
$1N1616: length 3.6
  Bottom Layer w0.4: D2.1 57.63,12.51 S2.2
$1N1673: length 3.6
  Bottom Layer w0.4: S3.2 38.58,12.51 D3.1
$1N1730: length 3.6
  Bottom Layer w0.4: S4.2 19.53,12.51 D4.1
$1N1787: length 6.1
  Bottom Layer w0.4: S5.2 76.42,37.2 D5.1
$1N1844: length 3.6
  Bottom Layer w0.4: D6.1 57.63,31.56 S6.2
$1N1901: length 3.6
  Bottom Layer w0.4: S7.2 38.58,31.56 D7.1
$1N1958: length 3.6
  Bottom Layer w0.4: D8.1 19.53,31.56 S8.2
$1N2015: length 4.6
  Bottom Layer w0.4: D9.1 76.42,54.97 S9.2
$1N2072: length 3.6
  Bottom Layer w0.4: D10.1 57.63,50.61 S10.2
$1N2129: length 3.6
  Bottom Layer w0.4: D11.1 38.58,50.61 S11.2
$1N2186: length 3.6
  Bottom Layer w0.4: D12.1 19.53,50.61 S12.2
$1N2243: length 6.7
  Bottom Layer w0.4: D13.1 76.55,69.53 S13.2
$1N2300: length 3.6
  Bottom Layer w0.4: D14.1 57.63,69.66 S14.2
$1N2357: length 3.6
  Bottom Layer w0.4: D15.1 38.58,69.66 S15.2
$1N2414: length 3.6
  Bottom Layer w0.4: D16.1 19.53,69.66 S16.2
$1N2471: length 3.6
  Bottom Layer w0.4: D17.1 76.68,88.71 S17.2
$1N2528: length 3.6
  Bottom Layer w0.4: D18.1 57.63,88.71 S18.2
$1N2585: length 3.6
  Bottom Layer w0.4: S19.2 38.58,88.71 D19.1
$1N2642: length 3.6
  Bottom Layer w0.4: D20.1 19.53,88.71 S20.2
$1N3491: length 9.4
  Bottom Layer w0.3: 81.26,105.55 82,104.81 84.38,104.81 85.15,105.58 87.87,105.58 89.14,104.31 89.14,103.91
$1N3495: length 10.2
  Bottom Layer w0.3: 83.57,105.7 83.61,105.7 83.95,106.04 90.47,106.04 92.15,104.36 92.15,103.67 92.15,103.66 92.15,103.6
$1N10093: length 14.1
  Bottom Layer w0.4: LED21.4 14.92,96.25 21.31,96.25 22.59,94.96 LED22.2
$1N10111: length 14.1
  Bottom Layer w0.4: LED23.4 52.89,96.38 64.68,96.38 66.1,94.96 LED24.2
$1N10115: length 14.1
  Bottom Layer w0.4: LED23.2 40.26,94.96 39.14,96.08 34.14,96.08 LED22.4
$1N10133: length 28.1
  Bottom Layer w0.4: LED25.4 71.37,77.9 71.37,78.24 70.84,78.77 66.26,78.77 66.03,79 65.48,79 65.25,78.77 58.8,78.77 54.58,74.54 48.22,74.54 47.7,75.07 47.7,75.42 LED26.2
$1N10151: length 30.5
  Bottom Layer w0.4: LED27.4 33.27,77.9 33.27,78.24 32.74,78.77 29.05,78.77 28.69,79.13 28.15,79.13 27.79,78.77 10.63,78.77 9.89,79.51 9.35,79.51 8.96,79.12 8.96,78.93 8.01,77.97 8.01,76.86 8.21,76.65 8.37,76.65 LED28.2
$1N10155: length 28.3
  Bottom Layer w0.4: LED26.4 52.32,77.9 52.32,78.24 51.79,78.77 47.84,78.77 47.36,79.25 46.81,79.25 46.33,78.77 39.75,78.77 35.53,74.54 29.17,74.54 28.65,75.07 28.65,75.42 LED27.2
$1N10173: length 14.1
  Bottom Layer w0.4: LED30.2 21.21,56.86 20.09,57.98 15.25,57.98 14.87,58.36 LED29.4
$1N10191: length 14.2
  Bottom Layer w0.4: LED32.2 65.52,57.6 65.36,57.6 65.16,57.81 65.16,57.96 64.76,58.36 LED31.4
$1N10195: length 14.2
  Bottom Layer w0.4: LED30.4 45.71,58.36 46.11,57.96 46.11,57.81 46.31,57.6 46.47,57.6 LED31.2
$1N10213: length 28.4
  Bottom Layer w0.4: LED34.2 47.7,37.32 47.7,36.97 48.22,36.44 54.46,36.44 58.9,40.88 71.09,40.88 71.53,40.43 71.53,39.64 LED33.4
$1N10231: length 29.8
  Bottom Layer w0.4: LED36.2 8.37,38.55 8.21,38.55 8.01,38.76 8.01,39.87 8.81,40.67 8.86,40.67 9.1,40.9 9.64,40.9 9.87,40.67 27.79,40.67 28.02,40.9 28.56,40.9 28.8,40.67 32.74,40.67 33.27,40.14 33.27,39.8 LED35.4
$1N10235: length 28.6
  Bottom Layer w0.4: LED35.2 28.65,37.32 28.65,36.97 29.17,36.44 35.03,36.44 39.47,40.88 46.67,40.88 46.81,41.03 47.36,41.03 47.51,40.88 52.17,40.88 52.61,40.43 52.61,39.51 LED34.4
$1N10253: length 14.2
  Bottom Layer w0.4: LED38.2 27.42,19.5 27.26,19.5 27.06,19.71 27.06,19.86 26.66,20.26 LED37.4
$1N10271: length 14.2
  Bottom Layer w0.4: LED39.4 64.76,20.26 65.16,19.86 65.16,19.71 65.36,19.5 65.52,19.5 LED40.2
$1N10275: length 14.2
  Bottom Layer w0.4: LED38.4 45.71,20.26 46.11,19.86 46.11,19.71 46.31,19.5 46.47,19.5 LED39.2
$1N47662: length 3.2
  Bottom Layer w0.4: U6.4 83.63,25.26 82.88,25.26
$1N58671: length 14
  Bottom Layer w0.3: AGND.1 100.8,28.28 GND.1 100.67,27.66 99.92,26.91 94,26.91 93.93,26.97 91.17,26.97 89.91,25.72
$1N83167: length 32.6
  Top Layer w0.4: v3(73.63,95.87) 75.54,93.96 75.54,88.21 73.12,85.79 v3(73.12,74.79)
  Bottom Layer w0.4: LED25.2 66.75,75.42 66.75,75.07 67.28,74.54 72.88,74.54 v3(73.12,74.79) ; v3(73.63,95.87) 73.04,96.46 LED24.4
$1N83175: length 33.2
  Bottom Layer w0.4: LED28.4 15.64,77.41 16.49,76.57 16.5,76.57 16.88,76.18 16.88,75.64 16.5,75.26 16.49,75.26 15.78,74.54 10.39,74.54 8.23,72.38 8.23,71.32 7.41,70.49 6.34,70.49 4.19,68.34 4.19,61.62 8.21,57.6 8.37,57.6 LED29.2
$1N83184: length 28
  Top Layer w0.4: v3(63.47,39.35) 65.49,41.37 65.49,41.54 66.37,42.42 66.54,42.42 70.84,46.72 70.84,51.15 72.73,53.05 72.73,57.63 v3(73.25,58.15)
  Bottom Layer w0.4: v3(63.47,39.35) 63.47,39.1 64.76,37.81 LED33.2 ; LED32.4 72.07,58.15 v3(73.25,58.15)
$1N83193: length 33.9
  Bottom Layer w0.4: LED36.4 16.39,39.31 16.99,38.72 16.99,36.94 16.49,36.44 11.09,36.44 9.46,34.81 9.46,34.06 6.15,30.75 4.83,30.75 4.19,30.12 4.19,23.52 8.21,19.5 8.37,19.5 LED37.2

## Copper pours and planes (outline as drawn; the poured copper is in the pictures)
GND on Top Layer: -1.81,112.13 108.17,112.13 108.17,-1.79 -1.81,-1.79
GND on Bottom Layer: -2.7,111.36 108.17,111.36 108.17,-2.56 -2.7,-2.56

## Text on the board
Bottom Silkscreen Layer: OE | +5V
Top Silkscreen Layer: USB3 Only
